# EAGLE design V2_eagle7 (EAGLE 7.7.0)

## Sheet 1 of 8: ATMEGA32
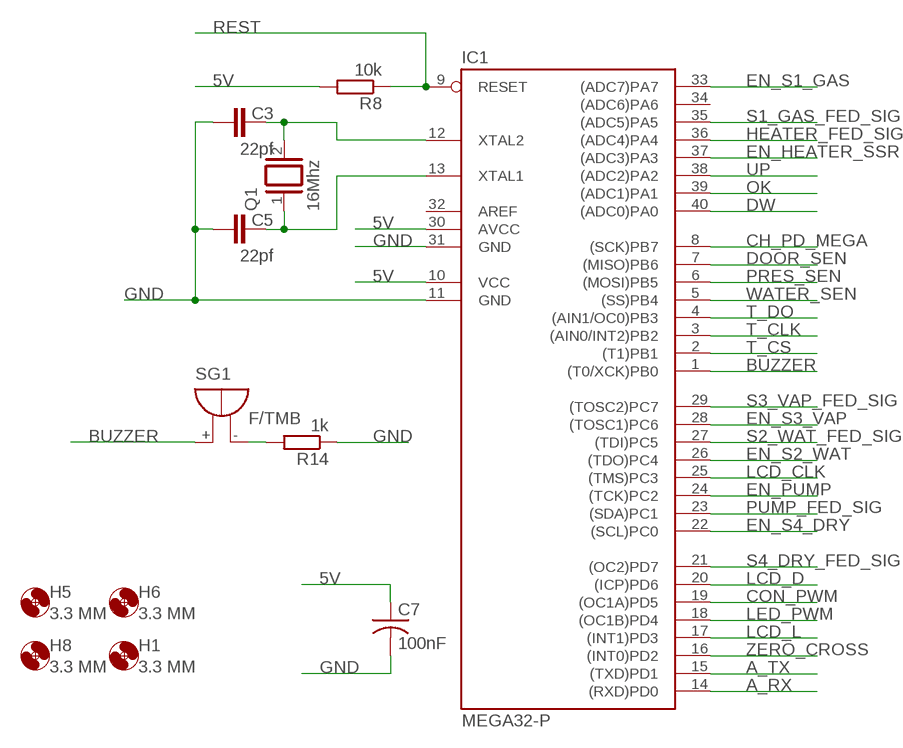
[diagram p0: schematic, sheet 1]

### Parts
C3  22pf  C-EU050-030X075  [C050-030X075]
C5  22pf  C-EU050-030X075  [C050-030X075]
C7  100nF  C-US050-035X075  [C050-035X075]
H1  3.3 MM  MOUNT-HOLE3.3  [3,3]
H5  3.3 MM  MOUNT-HOLE3.3  [3,3]
H6  3.3 MM  MOUNT-HOLE3.3  [3,3]
H8  3.3 MM  MOUNT-HOLE3.3  [3,3]
IC1  MEGA32-P  [DIL40]
Q1  16Mhz  XTAL/S  [QS]
R8  10k  R-EU_0207/10  [0207/10]
R14  1k  R-EU_0207/10  [0207/10]
SG1  F/TMB  [F/TMB]

### Nets
5V: C7.1 IC1.10(VCC) IC1.30(AVCC) R8.2 ; also sheet 2,7,8
A_RX: IC1.14((RXD)PD0) ; also sheet 4
A_TX: IC1.15((TXD)PD1) ; also sheet 4
BUZZER: IC1.1((T0/XCK)PB0) SG1.+
CH_PD_MEGA: IC1.8((SCK)PB7) ; also sheet 4
CON_PWM: IC1.19((OC1A)PD5) ; also sheet 3
DOOR_SEN: IC1.7((MISO)PB6) ; also sheet 6
DW: IC1.40((ADC0)PA0) ; also sheet 6
EN_HEATER_SSR: IC1.37((ADC3)PA3) ; also sheet 6
EN_PUMP: IC1.24((TCK)PC2) ; also sheet 2
EN_S1_GAS: IC1.33((ADC7)PA7) ; also sheet 2
EN_S2_WAT: IC1.26((TDO)PC4) ; also sheet 2
EN_S3_VAP: IC1.28((TOSC1)PC6) ; also sheet 2
EN_S4_DRY: IC1.22((SCL)PC0) ; also sheet 2
GND: C3.1 C5.1 C7.2 IC1.11(GND) IC1.31(GND) R14.1 ; also sheet 2,3,4,5,6,7,8
HEATER_FED_SIG: IC1.36((ADC4)PA4) ; also sheet 2
LCD_CLK: IC1.25((TMS)PC3) ; also sheet 3
LCD_D: IC1.20((ICP)PD6) ; also sheet 3
LCD_L: IC1.17((INT1)PD3) ; also sheet 3
LED_PWM: IC1.18((OC1B)PD4) ; also sheet 3
N$7: C5.2 IC1.13(XTAL1) Q1.1
N$16: C3.2 IC1.12(XTAL2) Q1.2
N$62: R14.2 SG1.-
OK: IC1.39((ADC1)PA1) ; also sheet 6
PRES_SEN: IC1.6((MOSI)PB5) ; also sheet 6
PUMP_FED_SIG: IC1.23((SDA)PC1) ; also sheet 2
REST: IC1.9(RESET) R8.1 ; also sheet 4
S1_GAS_FED_SIG: IC1.35((ADC5)PA5) ; also sheet 2
S2_WAT_FED_SIG: IC1.27((TDI)PC5) ; also sheet 2
S3_VAP_FED_SIG: IC1.29((TOSC2)PC7) ; also sheet 2
S4_DRY_FED_SIG: IC1.21((OC2)PD7) ; also sheet 2
T_CLK: IC1.3((AIN0/INT2)PB2) ; also sheet 8
T_CS: IC1.2((T1)PB1) ; also sheet 8
T_DO: IC1.4((AIN1/OC0)PB3) ; also sheet 8
UP: IC1.38((ADC2)PA2) ; also sheet 6
WATER_SEN: IC1.5((SS)PB4) ; also sheet 6
ZERO_CROSS: IC1.16((INT0)PD2) ; also sheet 5
Unconnected: IC1.32(AREF) IC1.34((ADC6)PA6)

## Sheet 2 of 8: Current Detect
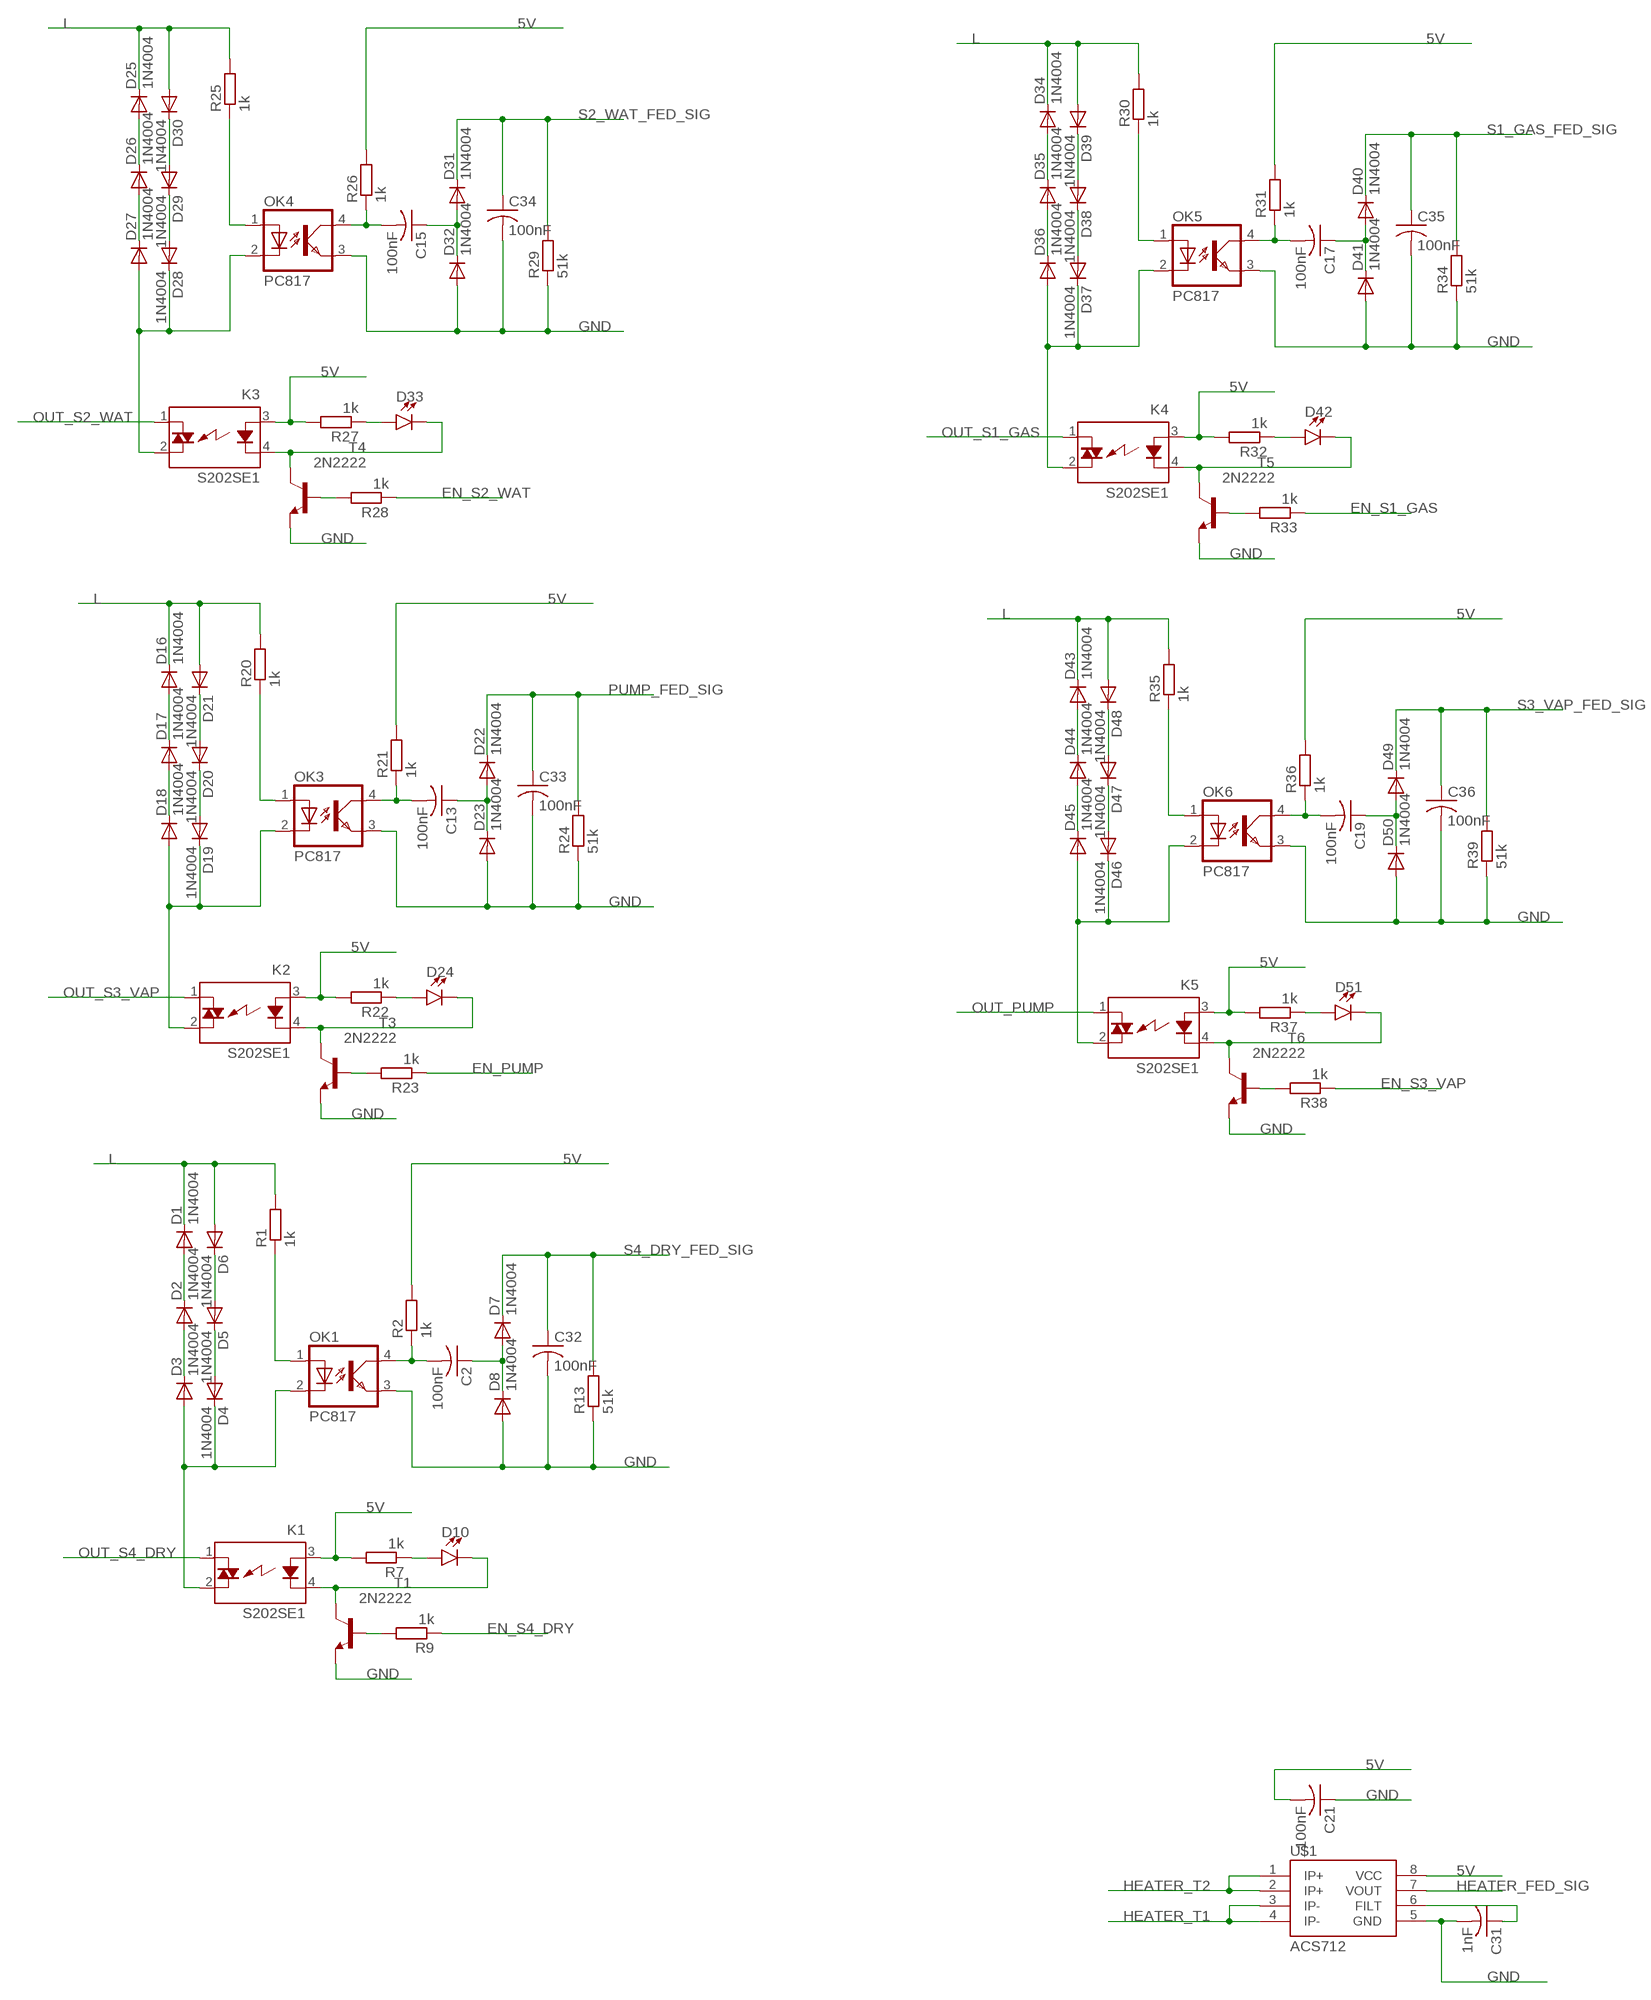
[diagram p1: schematic, sheet 2]

### Parts
C2  100nF  C-US050-035X075  [C050-035X075]
C13  100nF  C-US050-035X075  [C050-035X075]
C15  100nF  C-US050-035X075  [C050-035X075]
C17  100nF  C-US050-035X075  [C050-035X075]
C19  100nF  C-US050-035X075  [C050-035X075]
C21  100nF  C-US050-035X075  [C050-035X075]
C31  1nF  C-US050-035X075  [C050-035X075]
C32  100nF  C-US050-035X075  [C050-035X075]
C33  100nF  C-US050-035X075  [C050-035X075]
C34  100nF  C-US050-035X075  [C050-035X075]
C35  100nF  C-US050-035X075  [C050-035X075]
C36  100nF  C-US050-035X075  [C050-035X075]
D1  1N4004  [DO41-10]
D2  1N4004  [DO41-10]
D3  1N4004  [DO41-10]
D4  1N4004  [DO41-10]
D5  1N4004  [DO41-10]
D6  1N4004  [DO41-10]
D7  1N4004  [DO41-10]
D8  1N4004  [DO41-10]
D10  LED5MM  [LED_5MM]
D16  1N4004  [DO41-10]
D17  1N4004  [DO41-10]
D18  1N4004  [DO41-10]
D19  1N4004  [DO41-10]
D20  1N4004  [DO41-10]
D21  1N4004  [DO41-10]
D22  1N4004  [DO41-10]
D23  1N4004  [DO41-10]
D24  LED5MM  [LED_5MM]
D25  1N4004  [DO41-10]
D26  1N4004  [DO41-10]
D27  1N4004  [DO41-10]
D28  1N4004  [DO41-10]
D29  1N4004  [DO41-10]
D30  1N4004  [DO41-10]
D31  1N4004  [DO41-10]
D32  1N4004  [DO41-10]
D33  LED5MM  [LED_5MM]
D34  1N4004  [DO41-10]
D35  1N4004  [DO41-10]
D36  1N4004  [DO41-10]
D37  1N4004  [DO41-10]
D38  1N4004  [DO41-10]
D39  1N4004  [DO41-10]
D40  1N4004  [DO41-10]
D41  1N4004  [DO41-10]
D42  LED5MM  [LED_5MM]
D43  1N4004  [DO41-10]
D44  1N4004  [DO41-10]
D45  1N4004  [DO41-10]
D46  1N4004  [DO41-10]
D47  1N4004  [DO41-10]
D48  1N4004  [DO41-10]
D49  1N4004  [DO41-10]
D50  1N4004  [DO41-10]
D51  LED5MM  [LED_5MM]
K1  S202SE1  [S2XXEX]
K2  S202SE1  [S2XXEX]
K3  S202SE1  [S2XXEX]
K4  S202SE1  [S2XXEX]
K5  S202SE1  [S2XXEX]
OK1  PC817  [DIL04]
OK3  PC817  [DIL04]
OK4  PC817  [DIL04]
OK5  PC817  [DIL04]
OK6  PC817  [DIL04]
R1  1k  R-EU_0207/10  [0207/10]
R2  1k  R-EU_0207/10  [0207/10]
R7  1k  R-EU_0207/10  [0207/10]
R9  1k  R-EU_0207/10  [0207/10]
R13  51k  R-EU_0207/10  [0207/10]
R20  1k  R-EU_0207/10  [0207/10]
R21  1k  R-EU_0207/10  [0207/10]
R22  1k  R-EU_0207/10  [0207/10]
R23  1k  R-EU_0207/10  [0207/10]
R24  51k  R-EU_0207/10  [0207/10]
R25  1k  R-EU_0207/10  [0207/10]
R26  1k  R-EU_0207/10  [0207/10]
R27  1k  R-EU_0207/10  [0207/10]
R28  1k  R-EU_0207/10  [0207/10]
R29  51k  R-EU_0207/10  [0207/10]
R30  1k  R-EU_0207/10  [0207/10]
R31  1k  R-EU_0207/10  [0207/10]
R32  1k  R-EU_0207/10  [0207/10]
R33  1k  R-EU_0207/10  [0207/10]
R34  51k  R-EU_0207/10  [0207/10]
R35  1k  R-EU_0207/10  [0207/10]
R36  1k  R-EU_0207/10  [0207/10]
R37  1k  R-EU_0207/10  [0207/10]
R38  1k  R-EU_0207/10  [0207/10]
R39  51k  R-EU_0207/10  [0207/10]
T1  2N2222  [TO92-EBC-OVAL]
T3  2N2222  [TO92-EBC-OVAL]
T4  2N2222  [TO92-EBC-OVAL]
T5  2N2222  [TO92-EBC-OVAL]
T6  2N2222  [TO92-EBC-OVAL]
U$1  ACS712  [SO08]

### Nets
5V: C21.2 K1.3(A) K2.3(A) K3.3(A) K4.3(A) K5.3(A) R2.2 R7.2 R21.2 R22.2 R26.2 R27.2 R31.2 R32.2 R36.2 R37.2 U$1.8(VCC) ; also sheet 1,7,8
EN_PUMP: R23.1 ; also sheet 1
EN_S1_GAS: R33.1 ; also sheet 1
EN_S2_WAT: R28.1 ; also sheet 1
EN_S3_VAP: R38.1 ; also sheet 1
EN_S4_DRY: R9.1 ; also sheet 1
GND: C21.1 C31.2 C32.2 C33.2 C34.2 C35.2 C36.2 D8.A D23.A D32.A D41.A D50.A OK1.3(EMIT) OK3.3(EMIT) OK4.3(EMIT) OK5.3(EMIT) OK6.3(EMIT) R13.1 R24.1 R29.1 R34.1 R39.1 T1.E T3.E T4.E T5.E T6.E U$1.5(GND) ; also sheet 1,3,4,5,6,7,8
HEATER_FED_SIG: U$1.7(VOUT) ; also sheet 1
HEATER_T1: U$1.3(IP-) U$1.4(IP-) ; also sheet 6
HEATER_T2: U$1.1(IP+) U$1.2(IP+) ; also sheet 6
L: D1.C D6.A D16.C D21.A D25.C D30.A D34.C D39.A D43.C D48.A R1.2 R20.2 R25.2 R30.2 R35.2 ; also sheet 6
N$1: D2.A D3.C
N$2: D1.A D2.C
N$3: C2.2 OK1.4(COL) R2.1
N$4: C2.1 D7.A D8.C
N$5: D5.A D6.C
N$6: D4.A D5.C
N$8: D10.K(C) K1.4(K) T1.C
N$9: OK1.1(A) R1.1
N$10: D17.A D18.C
N$11: D10.A R7.1
N$13: R9.2 T1.B
N$14: D3.A D4.C K1.2(DS2) OK1.2(C)
N$15: D16.A D17.C
N$17: D20.A D21.C
N$18: D19.A D20.C
N$19: OK3.1(A) R20.1
N$20: C13.2 OK3.4(COL) R21.1
N$21: C13.1 D22.A D23.C
N$22: D18.A D19.C K2.2(DS2) OK3.2(C)
N$23: D24.A R22.1
N$24: D24.K(C) K2.4(K) T3.C
N$25: R23.2 T3.B
N$26: D26.A D27.C
N$27: D25.A D26.C
N$28: D29.A D30.C
N$29: D28.A D29.C
N$30: OK4.1(A) R25.1
N$31: C15.2 OK4.4(COL) R26.1
N$32: C15.1 D31.A D32.C
N$33: D27.A D28.C K3.2(DS2) OK4.2(C)
N$34: D33.A R27.1
N$35: D33.K(C) K3.4(K) T4.C
N$36: R28.2 T4.B
N$37: D35.A D36.C
N$38: D34.A D35.C
N$39: D38.A D39.C
N$40: D37.A D38.C
N$41: OK5.1(A) R30.1
N$42: C17.2 OK5.4(COL) R31.1
N$43: C17.1 D40.A D41.C
N$44: D36.A D37.C K4.2(DS2) OK5.2(C)
N$45: D42.A R32.1
N$46: D42.K(C) K4.4(K) T5.C
N$52: R33.2 T5.B
N$53: D44.A D45.C
N$56: D43.A D44.C
N$57: D47.A D48.C
N$58: D46.A D47.C
N$59: OK6.1(A) R35.1
N$60: C19.2 OK6.4(COL) R36.1
N$61: C19.1 D49.A D50.C
N$63: D45.A D46.C K5.2(DS2) OK6.2(C)
N$64: D51.A R37.1
N$65: D51.K(C) K5.4(K) T6.C
N$66: R38.2 T6.B
N$80: C31.1 U$1.6(FILT)
OUT_PUMP: K5.1(DS1) ; also sheet 6
OUT_S1_GAS: K4.1(DS1) ; also sheet 6
OUT_S2_WAT: K3.1(DS1) ; also sheet 6
OUT_S3_VAP: K2.1(DS1) ; also sheet 6
OUT_S4_DRY: K1.1(DS1) ; also sheet 6
PUMP_FED_SIG: C33.1 D22.C R24.2 ; also sheet 1
S1_GAS_FED_SIG: C35.1 D40.C R34.2 ; also sheet 1
S2_WAT_FED_SIG: C34.1 D31.C R29.2 ; also sheet 1
S3_VAP_FED_SIG: C36.1 D49.C R39.2 ; also sheet 1
S4_DRY_FED_SIG: C32.1 D7.C R13.2 ; also sheet 1

## Sheet 3 of 8: LCD_Shift
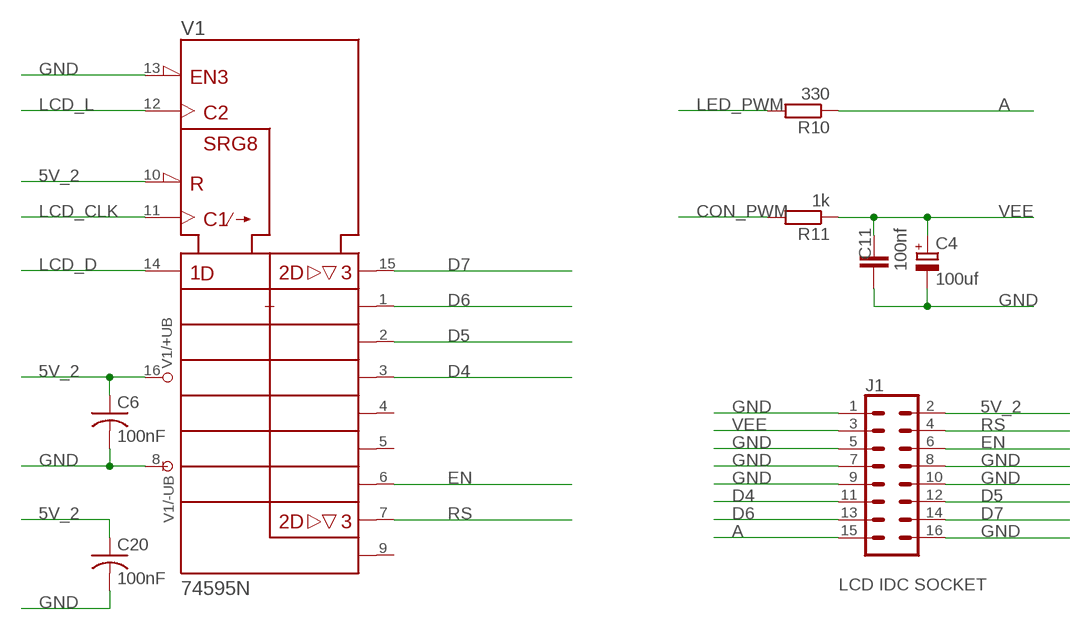
[diagram p2: schematic, sheet 3]

### Parts
C4  100uf  CPOL-EUE3.5-8  [E3,5-8]
C6  100nF  C-US050-035X075  [C050-035X075]
C11  100nf  C-EU050-030X075  [C050-030X075]
C20  100nF  C-US050-035X075  [C050-035X075]
J1  CONN_08X2  [2X8]
R10  330  R-EU_0207/10  [0207/10]
R11  1k  R-EU_0207/10  [0207/10]
V1  74595N  [DIL16]

### Nets
5V_2: C6.1 C20.1 J1.2 V1.10(!SRCLR) V1.16(+UB) ; also sheet 5,7
A: J1.15 R10.1
CON_PWM: R11.2 ; also sheet 1
D4: J1.11 V1.3(QD)
D5: J1.12 V1.2(QC)
D6: J1.13 V1.1(QB)
D7: J1.14 V1.15(QA)
EN: J1.6 V1.6(QG)
GND: C4.- C6.2 C11.1 C20.2 J1.1 J1.5 J1.7 J1.8 J1.9 J1.10 J1.16 V1.8(-UB) V1.13(!G) ; also sheet 1,2,4,5,6,7,8
LCD_CLK: V1.11(SRCK) ; also sheet 1
LCD_D: V1.14(SER) ; also sheet 1
LCD_L: V1.12(RCK) ; also sheet 1
LED_PWM: R10.2 ; also sheet 1
RS: J1.4 V1.7(QH)
VEE: C4.+ C11.2 J1.3 R11.1
Unconnected: V1.4(QE) V1.5(QF) V1.9(QH*)

### Notes on the sheet
- LCD IDC SOCKET

## Sheet 4 of 8: ESP LINK
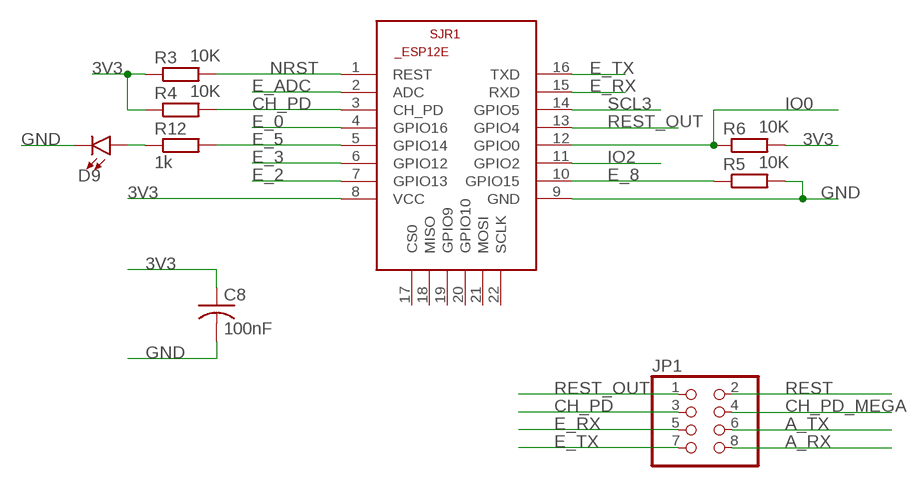
[diagram p3: schematic, sheet 4]

### Parts
C8  100nF  C-US050-035X075  [C050-035X075]
D9  LED5MM  [LED_5MM]
JP1  PINHD-2X4  [2X04]
R3  10K  R-EU_0207/10  [0207/10]
R4  10K  R-EU_0207/10  [0207/10]
R5  10K  R-EU_0207/10  [0207/10]
R6  10K  R-EU_0207/10  [0207/10]
R12  1k  R-EU_0207/10  [0207/10]
SJR1  ESP8266-12EESP12E  [ESP8266-ESP12E]

### Nets
3V3: C8.1 R3.1 R4.1 R6.2 SJR1.8(VCC) ; also sheet 7
A_RX: JP1.8 ; also sheet 1
A_TX: JP1.6 ; also sheet 1
CH_PD: JP1.3 R4.2 SJR1.3(CH_PD)
CH_PD_MEGA: JP1.4 ; also sheet 1
E_0: SJR1.4(GPIO16)
E_2: SJR1.7(GPIO13)
E_3: SJR1.6(GPIO12)
E_5: R12.2 SJR1.5(GPIO14)
E_8: R5.1 SJR1.10(GPIO15)
E_ADC: SJR1.2(ADC)
E_RX: JP1.5 SJR1.15(RXD)
E_TX: JP1.7 SJR1.16(TXD)
GND: C8.2 D9.K(C) R5.2 SJR1.9(GND) ; also sheet 1,2,3,5,6,7,8
IO0: R6.1 SJR1.12(GPIO0)
IO2: SJR1.11(GPIO2)
N$12: D9.A R12.1
NRST: R3.2 SJR1.1(REST)
REST: JP1.2 ; also sheet 1
REST_OUT: JP1.1 SJR1.13(GPIO4)
SCL3: SJR1.14(GPIO5)
Unconnected: SJR1.17(CS0) SJR1.18(MISO) SJR1.19(GPIO9) SJR1.20(GPIO10) SJR1.21(MOSI) SJR1.22(SCLK)

## Sheet 5 of 8: Zero_Cross Detect
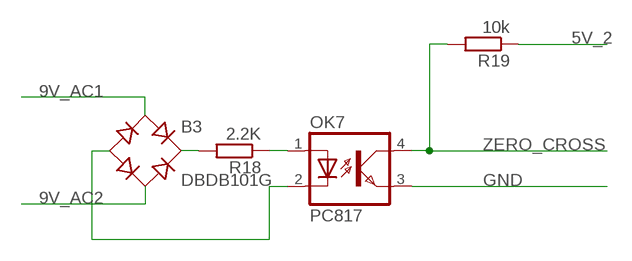
[diagram p4: schematic, sheet 5]

### Parts
B3  DBDB101G  [DB]
OK7  PC817  [DIL04]
R18  2.2K  R-EU_0207/10  [0207/10]
R19  10k  R-EU_0207/10  [0207/10]

### Nets
5V_2: R19.1 ; also sheet 3,7
9V_AC1: B3.AC1 ; also sheet 6,7
9V_AC2: B3.AC2 ; also sheet 6,7
GND: OK7.3(EMIT) ; also sheet 1,2,3,4,6,7,8
N$47: B3.+ R18.2
N$48: OK7.1(A) R18.1
N$49: B3.- OK7.2(C)
ZERO_CROSS: OK7.4(COL) R19.2 ; also sheet 1

## Sheet 6 of 8: Terminals
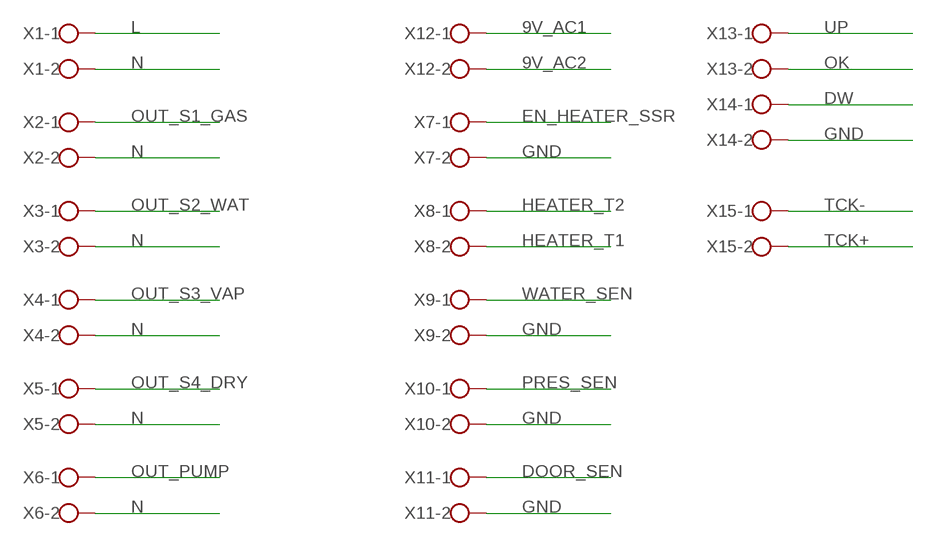
[diagram p5: schematic, sheet 6]

### Parts
X1  W237-102  [W237-102]
X2  W237-102  [W237-102]
X3  W237-102  [W237-102]
X4  W237-102  [W237-102]
X5  W237-102  [W237-102]
X6  W237-102  [W237-102]
X7  W237-102  [W237-102]
X8  W237-102  [W237-102]
X9  W237-102  [W237-102]
X10  W237-102  [W237-102]
X11  W237-102  [W237-102]
X12  W237-102  [W237-102]
X13  W237-102  [W237-102]
X14  W237-102  [W237-102]
X15  W237-102  [W237-102]

### Nets
9V_AC1: X12.1 ; also sheet 5,7
9V_AC2: X12.2 ; also sheet 5,7
DOOR_SEN: X11.1 ; also sheet 1
DW: X14.1 ; also sheet 1
EN_HEATER_SSR: X7.1 ; also sheet 1
GND: X7.2 X9.2 X10.2 X11.2 X14.2 ; also sheet 1,2,3,4,5,7,8
HEATER_T1: X8.2 ; also sheet 2
HEATER_T2: X8.1 ; also sheet 2
L: X1.1 ; also sheet 2
N: X1.2 X2.2 X3.2 X4.2 X5.2 X6.2
OK: X13.2 ; also sheet 1
OUT_PUMP: X6.1 ; also sheet 2
OUT_S1_GAS: X2.1 ; also sheet 2
OUT_S2_WAT: X3.1 ; also sheet 2
OUT_S3_VAP: X4.1 ; also sheet 2
OUT_S4_DRY: X5.1 ; also sheet 2
PRES_SEN: X10.1 ; also sheet 1
TCK+: X15.2 ; also sheet 8
TCK-: X15.1 ; also sheet 8
UP: X13.1 ; also sheet 1
WATER_SEN: X9.1 ; also sheet 1

## Sheet 7 of 8: POWER
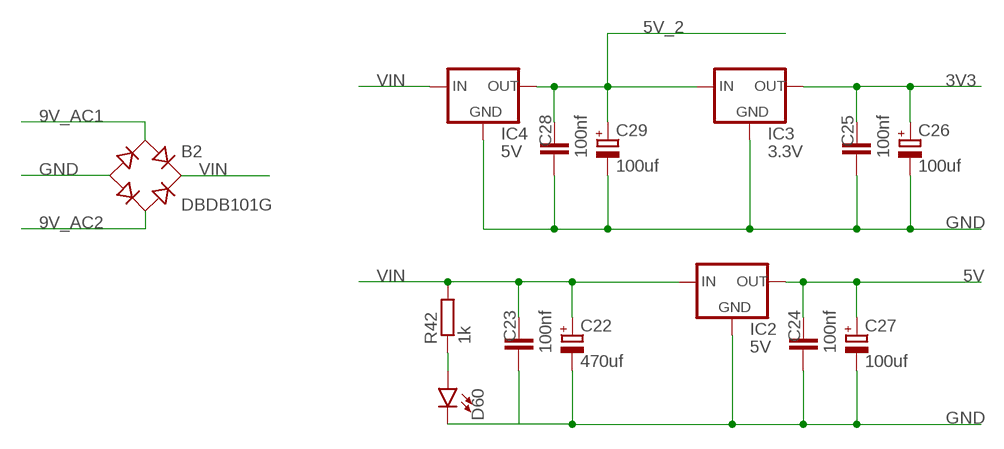
[diagram p6: schematic, sheet 7]

### Parts
B2  DBDB101G  [DB]
C22  470uf  CPOL-EUE3.5-8  [E3,5-8]
C23  100nf  C-EU050-030X075  [C050-030X075]
C24  100nf  C-EU050-030X075  [C050-030X075]
C25  100nf  C-EU050-030X075  [C050-030X075]
C26  100uf  CPOL-EUE3.5-8  [E3,5-8]
C27  100uf  CPOL-EUE3.5-8  [E3,5-8]
C28  100nf  C-EU050-030X075  [C050-030X075]
C29  100uf  CPOL-EUE3.5-8  [E3,5-8]
D60  LED5MM  [LED_5MM]
IC2  5V  V_REG_78XXSIDE  [78XXL]
IC3  3.3V  V_REG_78XXSIDE  [78XXL]
IC4  5V  V_REG_78XXSIDE  [78XXL]
R42  1k  R-EU_0207/10  [0207/10]

### Nets
3V3: C25.2 C26.+ IC3.OUT ; also sheet 4
5V: C24.2 C27.+ IC2.OUT ; also sheet 1,2,8
5V_2: C28.2 C29.+ IC3.IN IC4.OUT ; also sheet 3,5
9V_AC1: B2.AC1 ; also sheet 5,6
9V_AC2: B2.AC2 ; also sheet 5,6
GND: B2.- C22.- C23.1 C24.1 C25.1 C26.- C27.- C28.1 C29.- D60.K(C) IC2.GND IC3.GND IC4.GND ; also sheet 1,2,3,4,5,6,8
N$74: D60.A R42.1
VIN: B2.+ C22.+ C23.2 IC2.IN IC4.IN R42.2

## Sheet 8 of 8: Thermocoupler
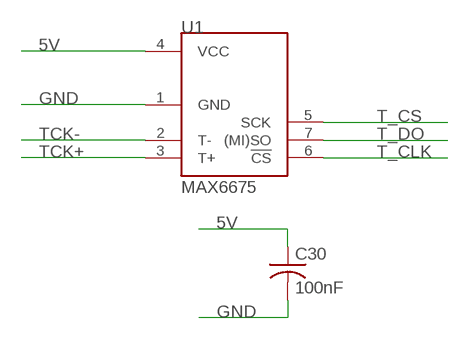
[diagram p7: schematic, sheet 8]

### Parts
C30  100nF  C-US050-035X075  [C050-035X075]
U1  MAX6675  [SOIC8]

### Nets
5V: C30.1 U1.4(VCC) ; also sheet 1,2,7
GND: C30.2 U1.1(GND) ; also sheet 1,2,3,4,5,6,7
T_CLK: U1.6(!CS) ; also sheet 1
T_CS: U1.5(SCK) ; also sheet 1
T_DO: U1.7((MI)SO) ; also sheet 1
TCK+: U1.3(T+) ; also sheet 6
TCK-: U1.2(T-) ; also sheet 6

## Library data of the parts
B2 B3 = rectifier:DB?*G: Single Phase 1.0 AMP Glass Passivated Bridge Rectifier Taiwan Semiconductor Co.,Ltd. - TSC Source: http://www.taiwansemi.com/TSCbig5/ezcatfiles/cust/img/img/db101g.pdf http://www.ts.com.tw/db/pictures/modules/PDT/PDT060207001/DBLS201G.pdf
C2 C6-C8 C13 C15 C17 C19-C21 C30-C36 = rcl@1:C-US: CAPACITOR, American symbol; SPICEPREFIX: C
C3 C5 C11 C23-C25 C28 = rcl:C-EU: CAPACITOR, European symbol
C4 C22 C26 C27 C29 = rcl:CPOL-EU: POLARIZED CAPACITOR, European symbol
D1-D8 D16-D23 D25-D32 D34-D41 D43-D50 = adafruit:1N4004: DIODE General purpose 1N400x type rectifier (With bigger pads) http://www.ladyada.net/library/pcb/eaglelibrary.html
D9 D10 D24 D33 D42 D51 D60 = SparkFun-LED:LED: LED (Generic) Standard schematic elements and footprints for 5mm, 3mm, 1206, and 0603 sized LEDs. Generic LEDs with no color specified.
H1 H5 H6 H8 = holes:MOUNT-HOLE: MOUNTING HOLE with drill center marker
IC1 = atmel:MEGA32-P: MICROCONTROLLER 32 Kbytes FLASH 2 Kbytes SRAM 1 Kbytes EEPROM USART 8-channel 10 bit ADC Source: www.atmel.com .. doc2503.pdf; MPN: ATMEGA32-16PU; OC_FARNELL: 1661729; OC_NEWARK: 51P1794
IC2-IC4 = SparkFun:V_REG_78XX: Voltage Regulator Standard 7805 5V regulator. IGO (Input Ground Output). Spark Fun Electronics SKU : COM-00107
J1 = SparkFun-Connectors:CONN_08X2: Multi connection point. Often used as Generic Header-pin footprint for 0.1 inch spaced/style header connections You can populate with any combo of single row headers, but if you'd like an exact match, check this: Header - 2x8 (Male, 0.1") <https://www.sparkfun.com/products/13156> (PRT-13156) On any of the 0.1 inch spaced packages, you can populate with these: Break Away Headers - Straight <https://www.sparkfun.com/products/116> (PRT-00116) Break Away Male Headers - Right Angle <https://www.sparkfun.com/products/553> (PRT-00553) Female Headers <https://www.sparkfun.com/products/115> (PRT-00115) Break Away Headers - Machine Pin <https://www.sparkfun.com/products/117> (PRT-00117) Break Away Female Headers - Swiss Machine Pin <https://www.sparkfun.com/products/743> (PRT-00743)
JP1 = pinhead:PINHD-2X4: PIN HEADER
K1-K5 = relay:S2*: SIP Type SSR for Medium Power Control SHARP Source: 168149-da-01-en-Solid_State_Relais_S_202_SE1_SE2.pdf; OC_FARNELL: unknown; OC_NEWARK: unknown
OK1 OK3-OK7 = optocoupler-2:PC817: SHARP OPTO COUPLER
Q1 = special:XTAL/S: CRYSTAL
R1 R2 R7-R14 R18-R39 R42 = rcl:R-EU_: RESISTOR, European symbol
R3-R6 = rcl@1:R-EU_: RESISTOR, European symbol; SPICEPREFIX: R
SG1 = buzzer:F/TMB: BUZZER Source: Buerklin; OC_FARNELL: unknown; OC_NEWARK: unknown
SJR1 = esp12e:ESP8266-12E: ESP8266-12E Library for Eagle CAD The author not responsible for any damages or errors!. Created by Suhail jr.lt;/author>
T1 T3-T6 = adafruit:2N2222: NPN TRANSISTOR Big oval pads
U1 = SparkFun-Retired:MAX6675: Cold-Junction-Compensated K-Thermocoupleto-Digital Converter (0°C to +1024°C) The MAX6675 performs cold-junction compensation and digitizes the signal from a type-K thermocouple. The data is output in a 12-bit resolution, SPI™-compatible, read-only format. This converter resolves temperatures to 0.25°C, allows readings as high as +1024°C, and exhibits thermocouple accuracy of 8LSBs for temperatures ranging from 0°C to +700°C. Dead Prototype: IC-12512; PROD_ID: IC-12512
U$1 = SparkFun-Sensors:ACS712: ACS712 Hall-effect-based isolated linear current sensor Datasheet <http://www.sparkfun.com/datasheets/BreakoutBoards/0712.pdf> SparkFun Products SparkFun Low Current Sensor Breakout - ACS712 <https://www.sparkfun.com/products/8883> (SEN-08883); PROD_ID: IC-08964
V1 = 74ttl-din:74*595: 8-bit SHIFT REGISTER, output latch
X1-X15 = con-wago-500:W237-102: WAGO SCREW CLAMP; MPN: 237-102; OC_FARNELL: unknown; OC_NEWARK: 70K9898

## Board
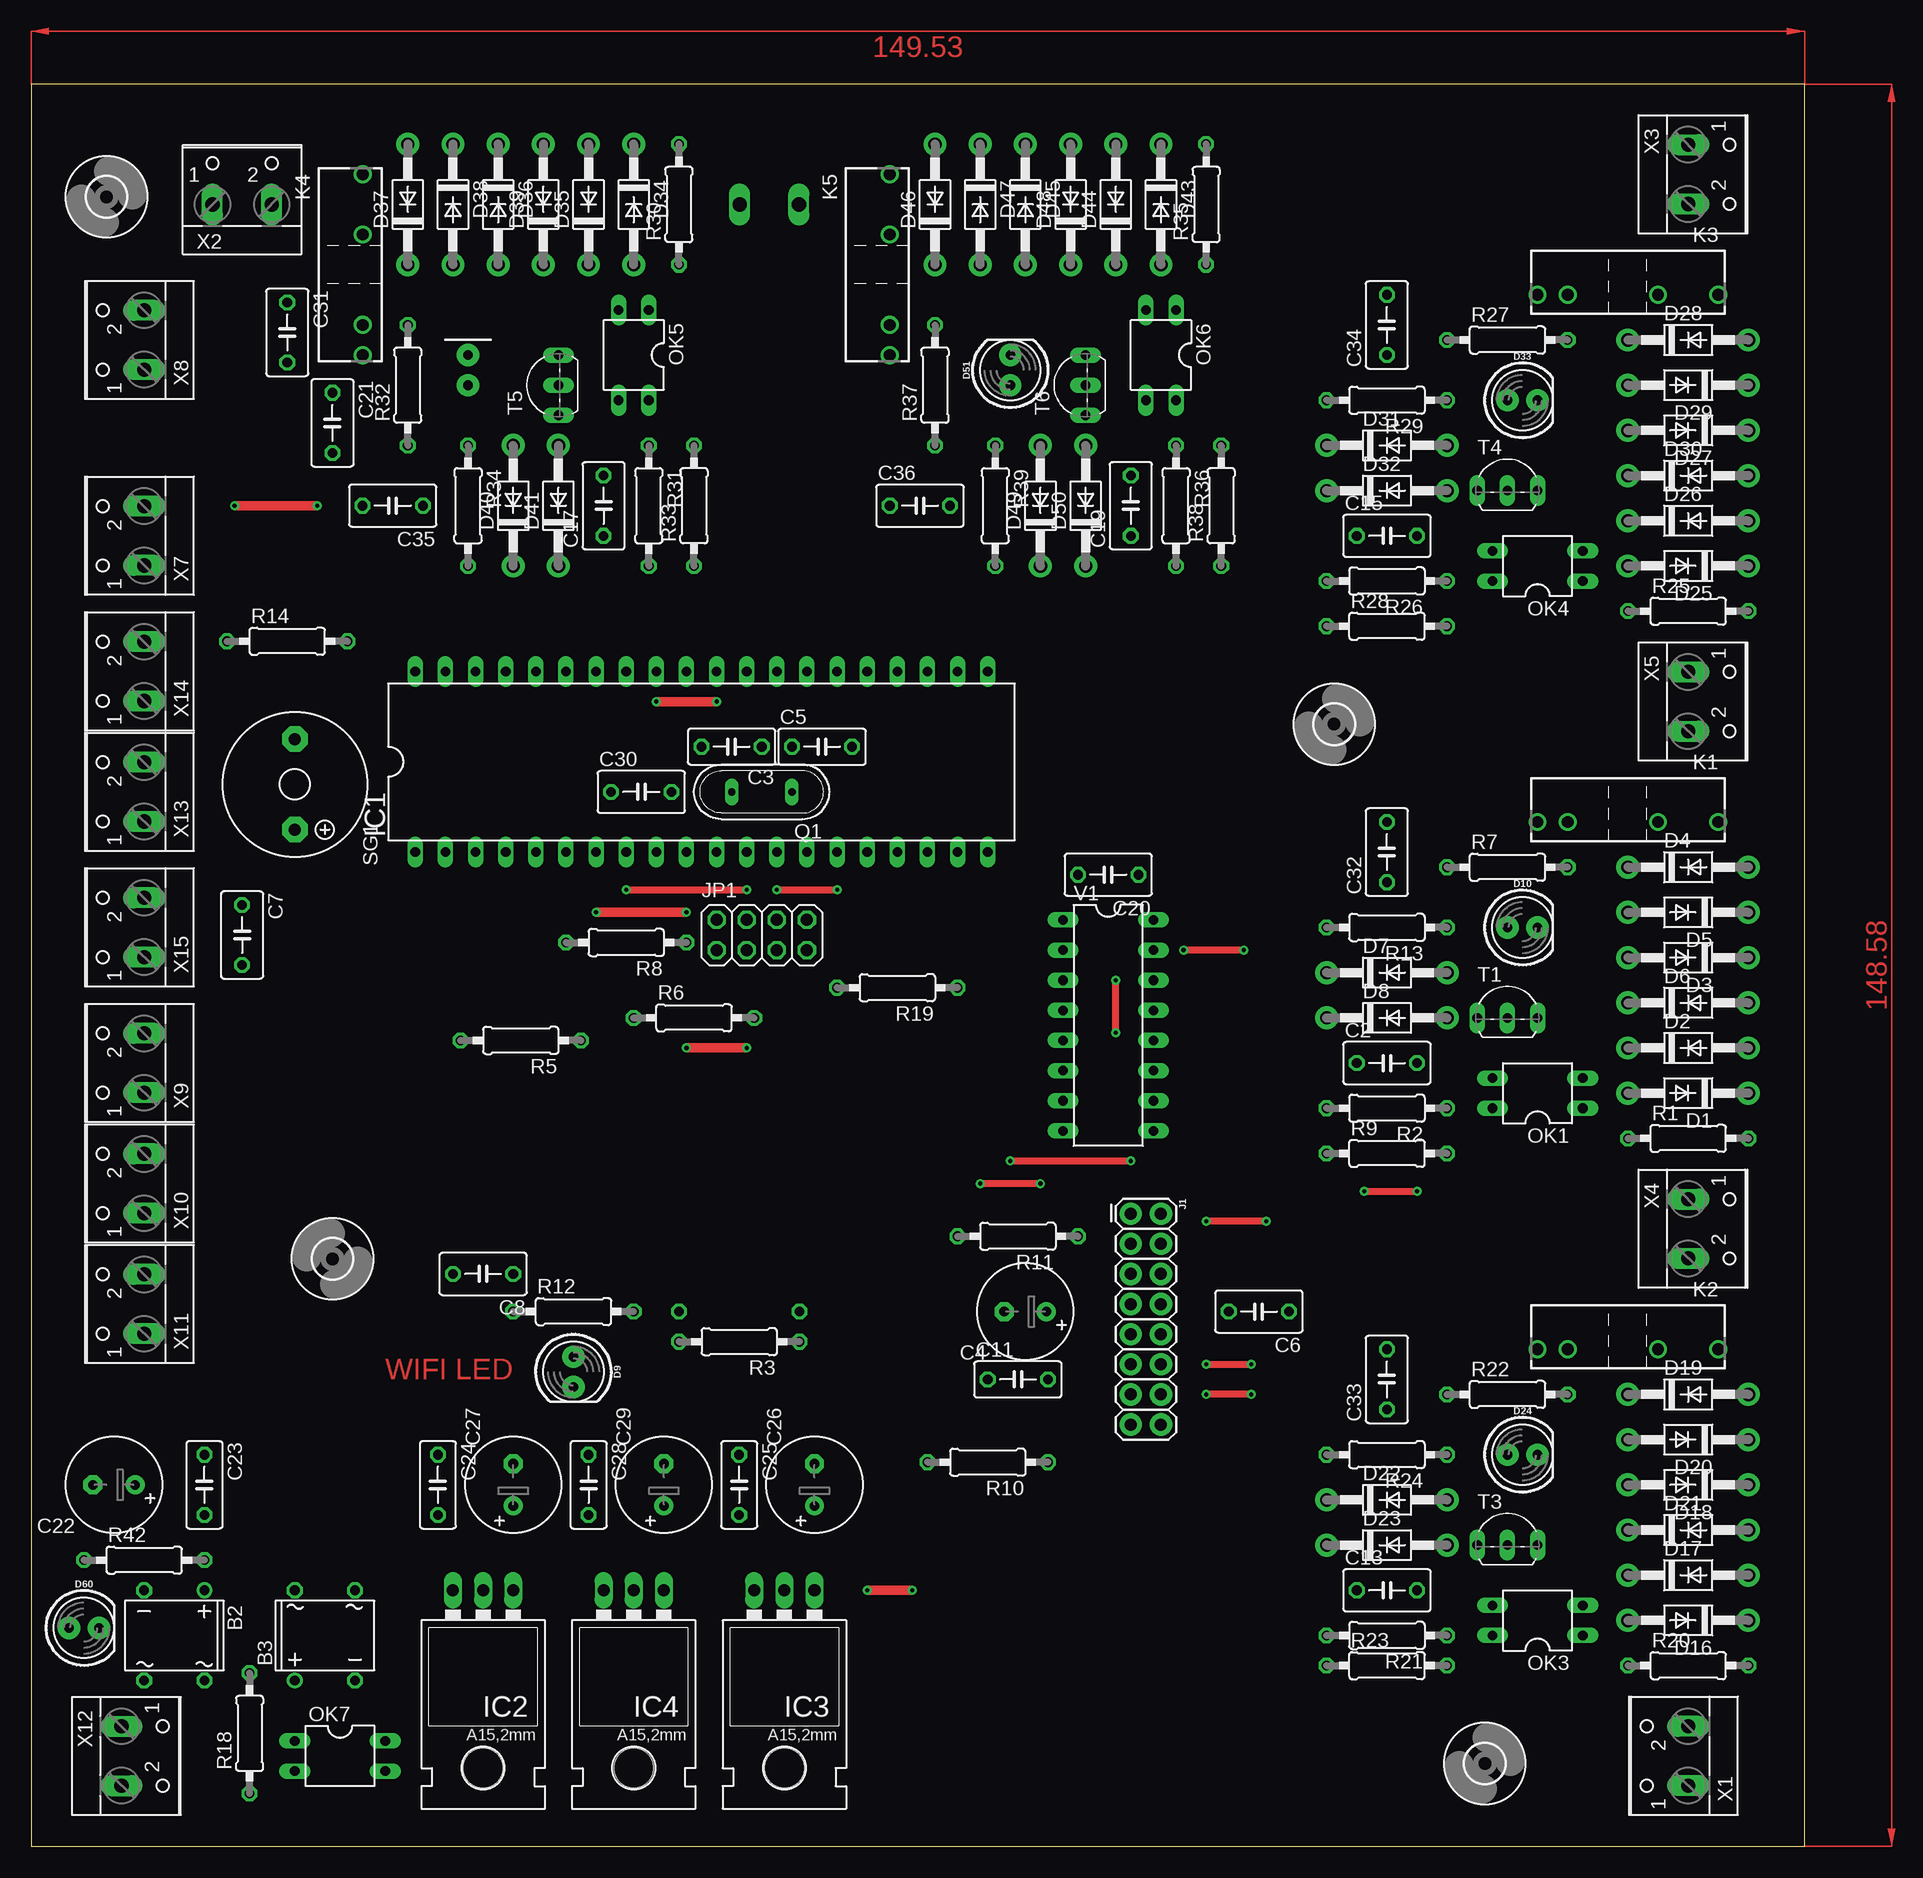
[diagram p8: board, top side]
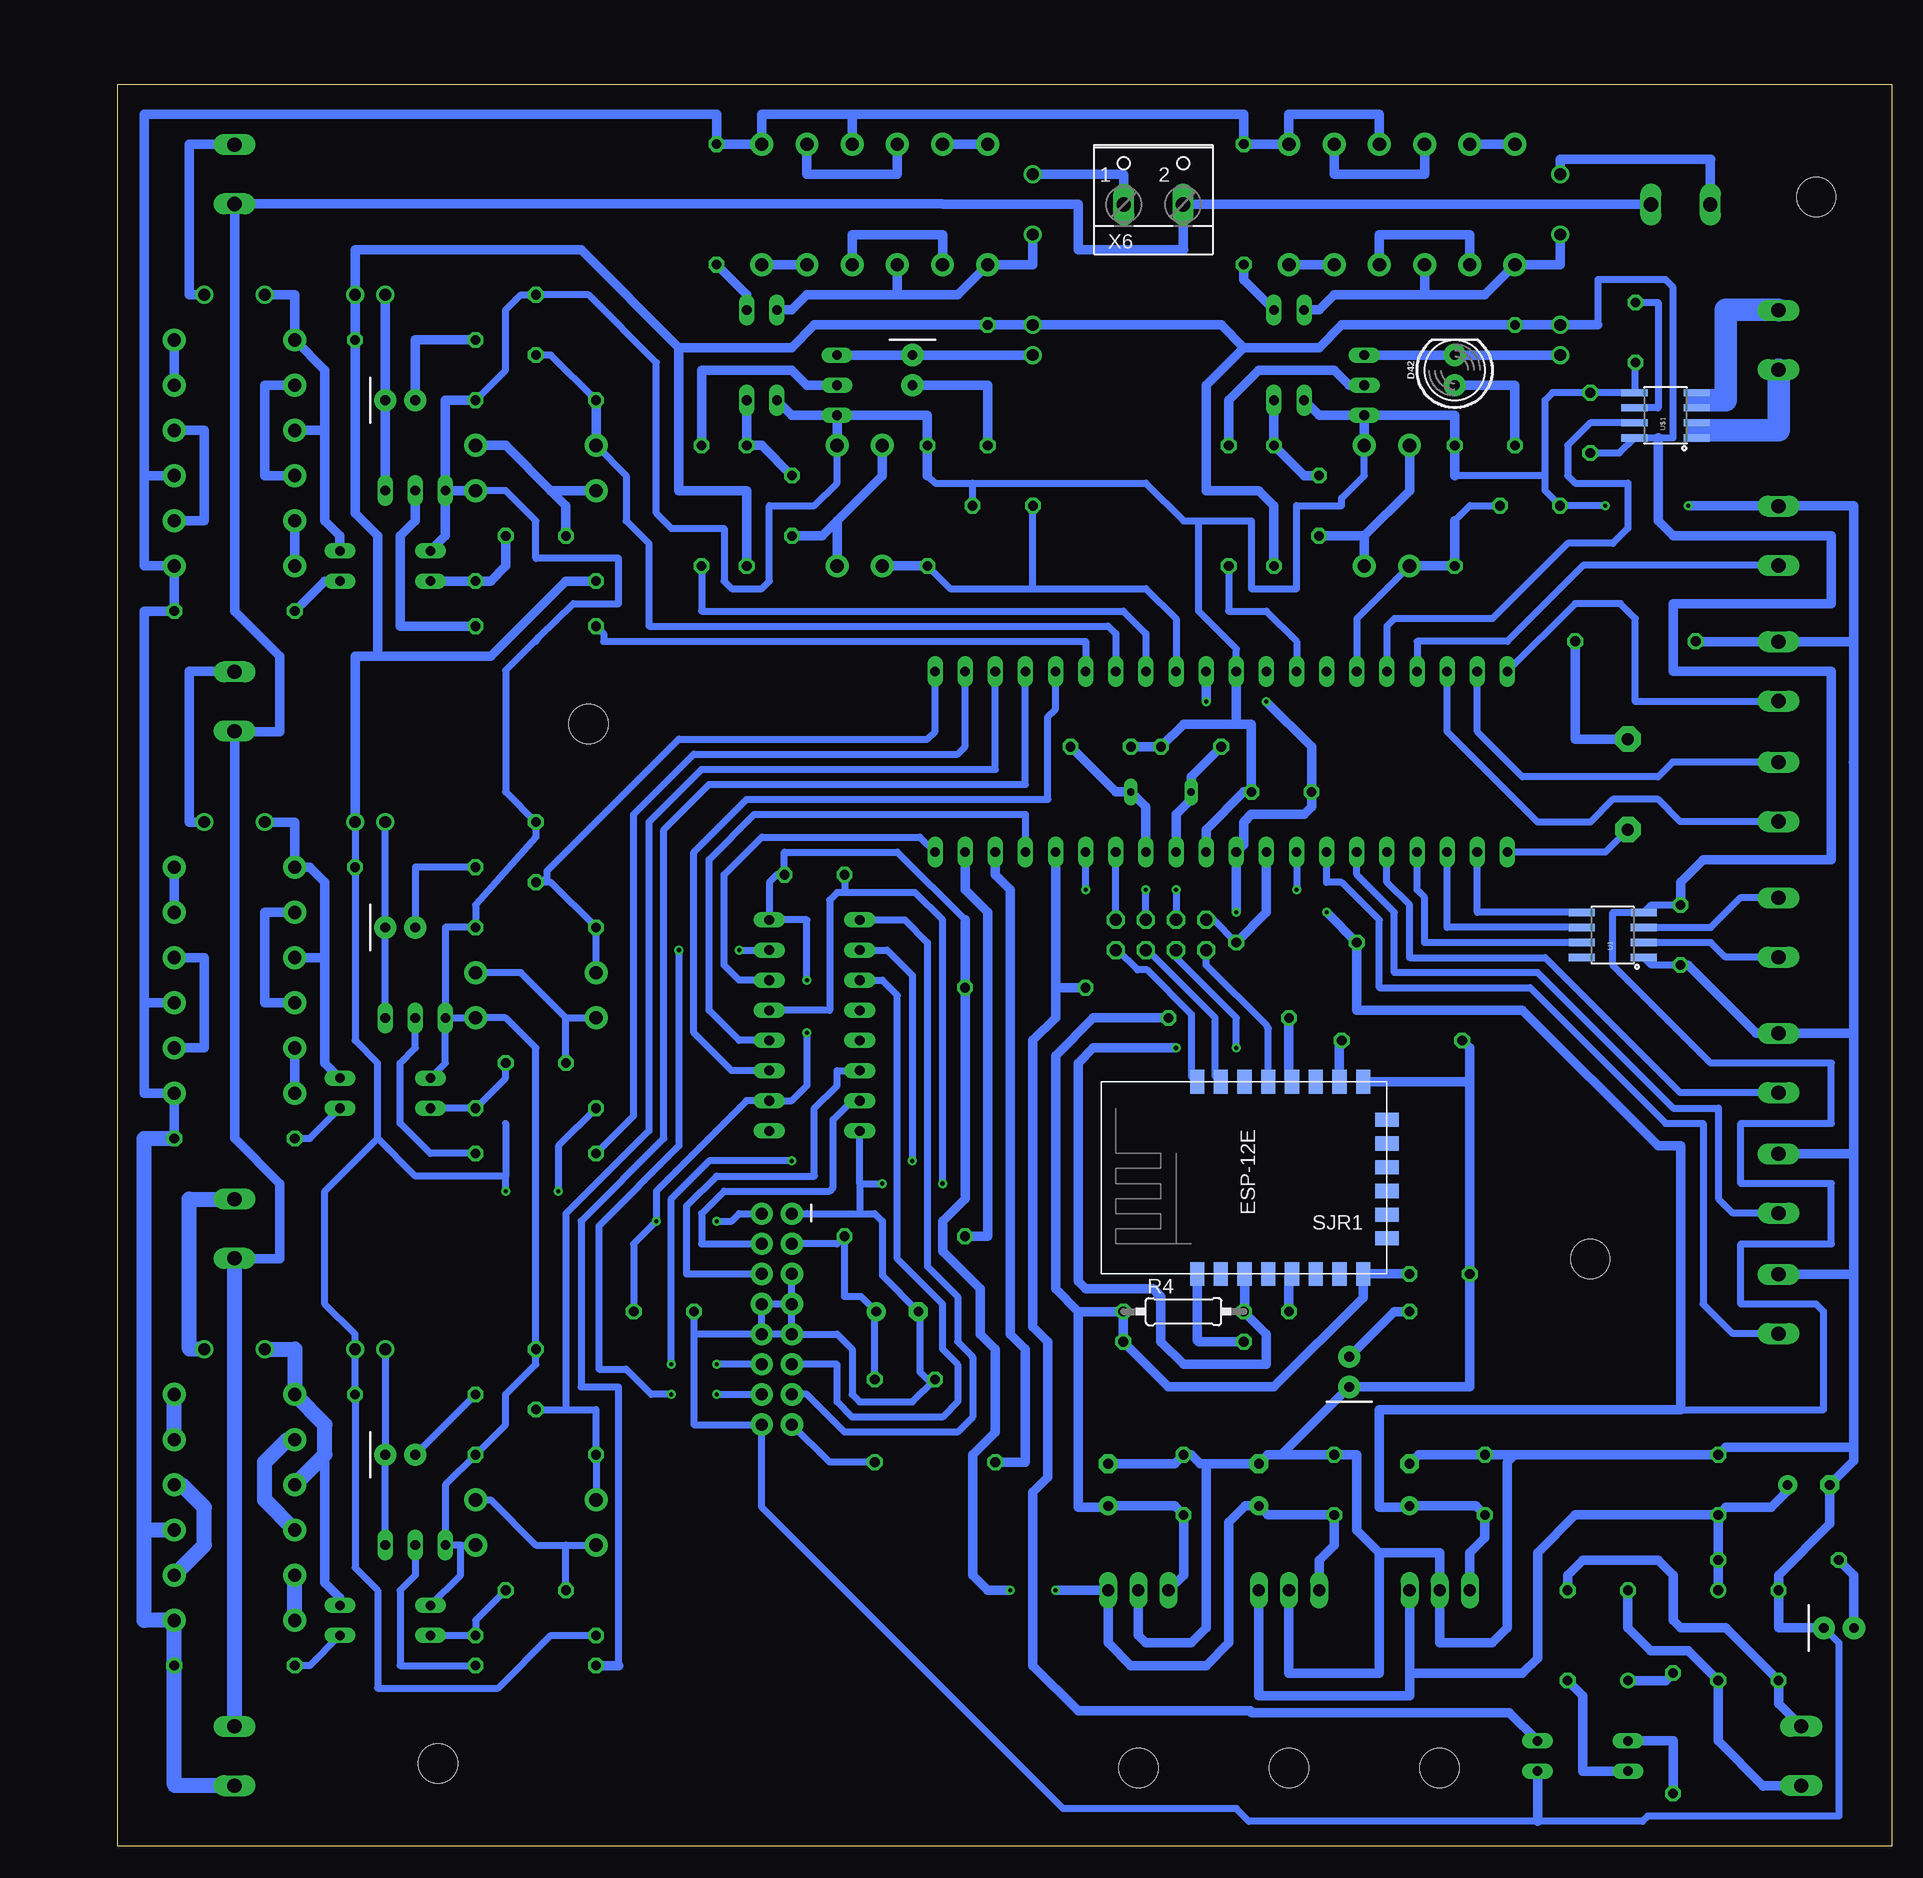
[diagram p9: board, bottom side, seen from below]

Size 149.53 x 148.58 mm. Coordinates in mm from the lower left corner, seen from the top.
Outline: 0,0 149.53,0 149.53,148.58 0,148.58 0,0
Copper layers (1*16): Top 0.035mm / dielectric 1.5mm / Bottom 0.035mm
Design rules "default *": minimum track width 6mil, minimum drill 0.35mm, track to track 24mil, track to pad 24mil, pad to pad 6mil, via to via 6mil, smd to smd 6mil, copper to edge 40mil, drill to drill 6mil, minimum pad ring 10mil, minimum via ring 8mil, stop-mask expansion 4mil, vias tented up to drill 0mil, thermal gap 10mil

### Footprints (pad centres in the part's own frame; a part is rotated, then mirrored left to right if it is on the bottom)
DB = drill 0.813: + -2.54,-3.81 | drill 0.813 octagon: - 2.54,-3.81; AC1 2.54,3.81; AC2 -2.54,3.81
C050-035X075 = drill 0.813 octagon: 1 -2.54,0; 2 2.54,0
C050-030X075 = drill 0.813 octagon: 1 -2.54,0; 2 2.54,0
E3,5-8 = drill 0.813 pad 1.6: + -1.778,0 | drill 0.813 pad 1.6 octagon: - 1.778,0
DO41-10 = drill 1.118 pad 1.93: A 5.08,0; C -5.08,0
LED_5MM = drill 0.813 pad 1.88: A -1.27,0; K 1.27,0
3,3 = hole 3.3: 0,0
DIL40 = drill 0.813 long: 1 -24.13,-7.62; 2 -21.59,-7.62; 3 -19.05,-7.62; 4 -16.51,-7.62; 5 -13.97,-7.62; 6 -11.43,-7.62; 7 -8.89,-7.62; 8 -6.35,-7.62; 9 -3.81,-7.62; 10 -1.27,-7.62; 11 1.27,-7.62; 12 3.81,-7.62; 13 6.35,-7.62; 14 8.89,-7.62; 15 11.43,-7.62; 16 13.97,-7.62; 17 16.51,-7.62; 18 19.05,-7.62; 19 21.59,-7.62; 20 24.13,-7.62; 21 24.13,7.62; 22 21.59,7.62; 23 19.05,7.62; 24 16.51,7.62; 25 13.97,7.62; 26 11.43,7.62; 27 8.89,7.62; 28 6.35,7.62; 29 3.81,7.62; 30 1.27,7.62; 31 -1.27,7.62; 32 -3.81,7.62; 33 -6.35,7.62; 34 -8.89,7.62; 35 -11.43,7.62; 36 -13.97,7.62; 37 -16.51,7.62; 38 -19.05,7.62; 39 -21.59,7.62; 40 -24.13,7.62
78XXL = drill 1.016 long: GND 0,-3.81; IN -2.54,-3.81; OUT 2.54,-3.81 | hole 3.302: 0,11.176
2X8 = drill 1.016 pad 1.88: 1 0,0; 2 0,2.54; 3 2.54,0; 4 2.54,2.54; 5 5.08,0; 6 5.08,2.54; 7 7.62,0; 8 7.62,2.54; 9 10.16,0; 10 10.16,2.54; 11 12.7,0; 12 12.7,2.54; 13 15.24,0; 14 15.24,2.54; 15 17.78,0; 16 17.78,2.54
2X04 = drill 1.016 octagon: 1 -3.81,-1.27; 2 -3.81,1.27; 3 -1.27,-1.27; 4 -1.27,1.27; 5 1.27,-1.27; 6 1.27,1.27; 7 3.81,-1.27; 8 3.81,1.27
S2XXEX = drill 1: 1 -7.62,0; 2 -2.54,0; 3 5.08,0; 4 7.62,0
DIL04 = drill 0.813 long: 1 -1.27,-3.81; 2 1.27,-3.81; 3 1.27,3.81; 4 -1.27,3.81
QS = drill 0.61 long: 1 -2.54,0; 2 2.54,0
0207/10 = drill 0.813 octagon: 1 -5.08,0; 2 5.08,0
F/TMB = drill 1.016 pad 2.159 octagon: + 3.81,0; - -3.81,0
ESP8266-ESP12E = smd 2 x 1.2: 1 -7.62,5.84; 2 -7.62,3.84; 3 -7.62,1.84; 4 -7.62,-0.16; 5 -7.62,-2.16; 6 -7.62,-4.16; 7 -7.62,-6.16; 8 -7.62,-8.16; 9 8.58,-8.16; 10 8.58,-6.16; 11 8.58,-4.16; 12 8.58,-2.16; 13 8.58,-0.16; 14 8.58,1.84; 15 8.58,3.84; 16 8.58,5.84 | smd 1.2 x 2: 17 -4.62,-10.16; 18 -2.62,-10.16; 19 -0.62,-10.16; 20 1.38,-10.16; 21 3.38,-10.16; 22 5.38,-10.16
TO92-EBC-OVAL = drill 0.813 long: B 0,-1.27; C 2.54,-1.27; E -2.54,-1.27
SOIC8 = smd 0.61 x 2.21: 1 -1.905,-2.616; 2 -0.635,-2.616; 3 0.635,-2.616; 4 1.905,-2.616; 5 1.905,2.616; 6 0.635,2.616; 7 -0.635,2.616; 8 -1.905,2.616
SO08 = smd 0.61 x 2.21: 1 -1.905,-2.616; 2 -0.635,-2.616; 3 0.635,-2.616; 4 1.905,-2.616; 5 1.905,2.616; 6 0.635,2.616; 7 -0.635,2.616; 8 -1.905,2.616
DIL16 = drill 0.813 long: 1 -8.89,-3.81; 2 -6.35,-3.81; 3 -3.81,-3.81; 4 -1.27,-3.81; 5 1.27,-3.81; 6 3.81,-3.81; 7 6.35,-3.81; 8 8.89,-3.81; 9 8.89,3.81; 10 6.35,3.81; 11 3.81,3.81; 12 1.27,3.81; 13 -1.27,3.81; 14 -3.81,3.81; 15 -6.35,3.81; 16 -8.89,3.81
W237-102 = drill 1.194 long: 1 -2.5,-1.27; 2 2.5,-1.27

### Placement (x,y rotation side)
B2  12.06,17.78 180 top
B3  24.77,17.78 0 top
C2  114.3,66.04 0 top
C3  59.05,92.71 180 top
C4  83.82,45.09 180 top
C5  66.67,92.71 0 top
C6  103.5,45.09 180 top
C7  17.78,76.83 270 top
C8  38.1,48.26 180 top
C11  83.19,39.37 0 top
C13  114.3,21.59 0 top
C15  114.3,110.49 0 top
C17  48.26,113.03 90 top
C19  92.71,113.03 90 top
C20  90.81,81.92 180 top
C21  25.4,120.02 270 top
C22  6.99,30.48 180 top
C23  14.61,30.48 270 top
C24  34.29,30.48 270 top
C25  59.69,30.48 270 top
C26  66.04,30.48 90 top
C27  40.64,30.48 90 top
C28  46.99,30.48 270 top
C29  53.34,30.48 90 top
C30  51.44,88.9 0 top
C31  21.59,127.64 270 top
C32  114.3,83.82 90 top
C33  114.3,39.37 90 top
C34  114.3,128.27 90 top
C35  30.48,113.03 180 top
C36  74.93,113.03 0 top
D1  139.7,63.5 180 top
D2  139.7,67.31 0 top
D3  139.7,74.93 180 top
D4  139.7,82.55 0 top
D5  139.7,78.74 180 top
D6  139.7,71.12 0 top
D7  114.3,73.66 0 top
D8  114.3,69.85 0 top
D9  45.72,40.01 270 top
D10  125.73,77.47 0 top
D16  139.7,19.05 180 top
D17  139.7,22.86 0 top
D18  139.7,30.48 180 top
D19  139.7,38.1 0 top
D20  139.7,34.29 180 top
D21  139.7,26.67 0 top
D22  114.3,29.21 0 top
D23  114.3,25.4 0 top
D24  125.73,33.02 0 top
D25  139.7,107.95 180 top
D26  139.7,111.76 0 top
D27  139.7,119.38 180 top
D28  139.7,127 0 top
D29  139.7,123.19 180 top
D30  139.7,115.57 0 top
D31  114.3,118.11 0 top
D32  114.3,114.3 0 top
D33  125.73,121.92 0 top
D34  50.8,138.43 270 top
D35  46.99,138.43 90 top
D36  39.37,138.43 270 top
D37  31.75,138.43 90 top
D38  35.56,138.43 270 top
D39  43.18,138.43 90 top
D40  40.64,113.03 90 top
D41  44.45,113.03 90 top
D42  36.83,124.46 90 bottom
D43  95.25,138.43 270 top
D44  91.44,138.43 90 top
D45  83.82,138.43 270 top
D46  76.2,138.43 90 top
D47  80.01,138.43 270 top
D48  87.63,138.43 90 top
D49  85.09,113.03 90 top
D50  88.9,113.03 90 top
D51  82.55,124.46 90 top
D60  4.45,18.41 0 top
H1  25.4,49.53 90 top
H5  109.86,94.61 0 top
H6  122.56,6.99 0 top
H8  6.35,139.06 0 top
IC1  56.52,91.44 0 top
IC2  38.1,17.78 180 top
IC3  63.5,17.78 180 top
IC4  50.8,17.78 180 top
J1  92.71,53.34 270 top
JP1  61.59,76.83 0 top
K1  134.62,86.36 180 top
K2  134.62,41.91 180 top
K3  134.62,130.81 180 top
K4  27.94,133.35 270 top
K5  72.39,133.35 270 top
OK1  127,63.5 90 top
OK3  127,19.05 90 top
OK4  127,107.95 90 top
OK5  50.8,125.73 180 top
OK6  95.25,125.73 180 top
OK7  26.04,7.62 270 top
Q1  61.59,88.9 180 top
R1  139.7,59.69 0 top
R2  114.3,62.23 180 top
R3  59.69,42.55 180 top
R4  59.69,45.09 0 bottom
R5  41.27,67.94 180 top
R6  55.88,69.85 0 top
R7  124.46,82.55 0 top
R8  50.16,76.2 180 top
R9  114.3,58.42 0 top
R10  80.64,32.38 180 top
R11  83.19,51.44 180 top
R12  45.72,45.09 0 top
R13  114.3,77.47 180 top
R14  21.59,101.6 0 top
R18  18.41,9.53 90 top
R19  73.03,72.39 180 top
R20  139.7,15.24 0 top
R21  114.3,17.78 180 top
R22  124.46,38.1 0 top
R23  114.3,15.24 0 top
R24  114.3,33.02 180 top
R25  139.7,104.14 0 top
R26  114.3,106.68 180 top
R27  124.46,127 0 top
R28  114.3,102.87 0 top
R29  114.3,121.92 180 top
R30  54.61,138.43 90 top
R31  52.07,113.03 270 top
R32  31.75,123.19 90 top
R33  55.88,113.03 90 top
R34  36.83,113.03 270 top
R35  99.06,138.43 90 top
R36  96.52,113.03 270 top
R37  76.2,123.19 90 top
R38  100.33,113.03 90 top
R39  81.28,113.03 270 top
R42  9.53,24.13 0 top
SG1  22.23,89.53 270 top
SJR1  52.7,55.88 90 bottom
T1  124.46,71.12 0 top
T3  124.46,26.67 0 top
T4  124.46,115.57 0 top
T5  43.18,123.19 90 top
T6  87.63,123.19 90 top
U1  23.5,76.83 90 bottom
U$1  19.05,120.65 90 bottom
V1  90.81,69.22 270 top
X1  138.43,7.62 90 top
X2  17.78,139.7 0 top
X3  140.97,140.97 270 top
X4  140.97,52.07 270 top
X5  140.97,96.52 270 top
X6  62.23,139.7 0 bottom
X7  8.26,110.49 90 top
X8  8.26,127 90 top
X9  8.26,66.04 90 top
X10  8.26,55.88 90 top
X11  8.26,45.72 90 top
X12  8.89,7.62 270 top
X13  8.26,88.9 90 top
X14  8.26,99.06 90 top
X15  8.26,77.47 90 top

### Tracks (layer width: path | path; a pad name or v marks a point on that pad's centre or on a via)
3V3
  Bottom 0.813: IC3.OUT 59.69,22.86 C25.2 60.45,28.7 C26.+ 66.17,28.57 68.58,28.57 68.58,45.09 | C8.1 SJR1.8 44.55,46.26 52.07,38.73 60.96,38.73 R3.1 R4.1 68.58,45.09 | R6.2 67.31,69.85 70.48,66.67 70.48,46.99 68.58,45.09
5V  (via drill 0.35)
  Top 0.61: v112.39,55.24 v116.84,55.24
  Top 0.813: v57.78,96.52 v52.7,96.52 | v47.62,78.74 v55.24,78.74
  Bottom 0.61: 116.84,60.96 116.84,56.52 | 116.84,56.52 124.46,56.52 127.64,59.69 | 127.64,59.69 127.64,66.04 129.54,67.94 R7.2 K1.3 | 127.64,59.69 132.08,55.24 132.08,45.72 129.54,43.18 K2.3 R22.2 129.54,23.5 127.64,21.59 127.64,13.34 117.47,13.34 113.03,17.78 R21.2 | 24.77,128.27 24.77,132.08 19.05,132.08 18.41,131.44 18.41,118.75 19.68,118.75 U$1.8 22.94,117.47 C21.2 | C7.1 20.24,79.38 U1.4 23.5,78.74 23.5,74.3 15.24,66.04 5.08,66.04 5.08,60.96 12.7,60.96 12.7,55.88 5.08,55.88 5.08,50.8 12.7,50.8 12.7,45.72 6.35,45.72 5.71,45.09 5.71,36.83 17.78,36.83 27.94,36.83 | R2.2 112.39,59.05 v112.39,55.24 | v116.84,55.24 116.84,56.52
  Bottom 0.813: 24.77,128.27 K4.3 R32.2 46.35,128.27 48.26,126.36 54.61,126.36 | 54.61,126.36 56.52,128.27 K5.3 R37.2 90.81,128.27 92.71,126.36 102.23,126.36 | R31.2 52.07,113.03 53.34,114.3 57.78,114.3 57.78,123.19 54.61,126.36 | R36.2 96.52,114.3 102.23,114.3 102.23,126.36 | R26.2 111.76,106.68 118.11,100.33 127.64,100.33 | 127.64,100.33 127.64,110.49 129.54,112.39 R27.2 K3.3 129.54,134.62 110.49,134.62 102.23,126.36 | K1.3 129.54,100.33 127.64,100.33 | IC2.OUT 35.56,24.77 34.29,26.04 C24.2 35.05,28.7 C27.+ 40.77,28.57 43.18,28.57 43.18,36.83 17.78,36.83 17.78,59.05 19.68,59.05 31.11,70.48 45.09,70.48 R8.2 v47.62,78.74 | C7.1 17.78,81.28 15.88,83.19 5.08,83.19 5.08,99.06 18.41,99.06 18.41,104.78 5.08,104.78 5.08,110.49 18.41,110.49 19.68,111.76 19.68,118.75 | IC1.30 v57.78,96.52 | v52.7,96.52 48.9,92.71 C30.1 48.9,87.63 49.53,87 53.98,87 54.61,86.36 54.61,84.45 IC1.10 v55.24,78.74
5V_2  (via drill 0.35)
  Top 0.61: v104.14,52.7 v99.06,52.7 | v91.44,68.58 v91.44,73.03
  Top 0.813: v70.48,21.59 v74.3,21.59
  Bottom 0.61: v99.06,52.7 97.79,52.7 97.16,53.34 J1.2 | v91.44,73.03 91.44,78.11 V1.16 94.61,81.28 93.98,81.92 C20.1 93.34,83.82 83.82,83.82 78.11,78.11 | v91.44,68.58 91.44,64.14 92.71,62.87 V1.10 96.52,62.87 104.14,55.24 v104.14,52.7 106.05,50.8 C6.1
  Bottom 0.813: IC4.OUT 48.26,24.13 46.99,25.4 C28.2 52.58,27.94 C29.+ 54.48,28.7 55.88,27.3 55.88,17.14 57.78,15.24 64.14,15.24 66.04,17.14 IC3.IN v70.48,21.59 | 78.11,78.11 R19.1 78.11,54.61 80.01,52.7 80.01,50.16 76.83,46.99 76.83,43.18 75.56,41.91 75.56,34.92 77.47,33.02 77.47,22.86 76.2,21.59 v74.3,21.59
9V_AC1
  Bottom 0.813: X12.1 9.53,12.03 B2.AC1 13.97,18.41 17.78,18.41 18.41,19.05 18.41,22.86 19.68,24.13 26.04,24.13 27.3,22.86 B3.AC1
9V_AC2
  Bottom 0.813: X12.2 10.76,5.12 10.79,5.08 14.61,8.89 B2.AC2 17.14,16.51 20.32,16.51 22.23,18.41 B3.AC2
A
  Bottom 0.61: R10.1 89.53,32.38 J1.15
A_RX
  Bottom 0.61: JP1.8 IC1.14
A_TX  (via drill 0.35)
  Top 0.61: v62.87,80.64 v67.94,80.64
  Bottom 0.61: JP1.6 v62.87,80.64 | v67.94,80.64 IC1.15
BUZZER
  Bottom 0.61: SG1.+ 24.13,83.82 IC1.1
CH_PD  (via drill 0.35)
  Top 0.813: v60.33,67.31 v55.24,67.31
  Bottom 0.61: JP1.3 60.33,74.93 55.24,69.85 v55.24,67.31
  Bottom 0.813: SJR1.3 54.55,45.15 R4.2 52.7,43.18 52.7,40.64 59.69,40.64 61.59,42.55 61.59,46.35 62.23,46.99 67.94,46.99 68.58,47.62 68.58,66.04 67.31,67.31 v60.33,67.31
CH_PD_MEGA  (via drill 0.35)
  Top 0.61: v50.16,80.64 v60.33,80.64
  Bottom 0.61: IC1.8 v50.16,80.64 | v60.33,80.64 JP1.4
CON_PWM
  Bottom 0.813: R11.2 76.2,51.44 76.2,78.74 78.11,80.64 IC1.19
D4
  Bottom 0.61: V1.3 85.09,73.03 83.82,71.75 83.82,49.53 80.01,45.72 80.01,41.91 78.74,40.64 78.74,37.47 80.01,36.2 87.63,36.2 88.9,37.47 88.9,40.64 J1.11
D5  (via drill 0.35)
  Top 0.61: v99.06,40.64 v102.87,40.64 | v82.55,57.78 v92.71,57.78
  Bottom 0.61: J1.12 v99.06,40.64 | v102.87,40.64 102.87,54.61 99.69,57.78 v92.71,57.78 | V1.2 84.68,75.56 82.55,73.43 82.55,68.58 v82.55,57.78
D6
  Bottom 0.61: V1.1 83.19,78.11 81.28,76.2 81.28,48.9 78.74,46.35 78.74,42.55 77.52,41.33 | J1.13 91.44,38.1 88.27,34.92 78.74,34.92 77.47,36.2 77.47,41.27 77.52,41.33 | 77.52,41.33 77.52,41.27
D7  (via drill 0.35)
  Top 0.61: v102.87,38.1 v99.06,38.1 | v102.23,75.56 v97.16,75.56
  Bottom 0.61: v99.06,38.1 J1.14 | v97.16,75.56 V1.15 | v102.23,75.56 102.23,59.05 108.99,52.3 108.99,40.23 106.69,40.23 104.56,38.1 v102.87,38.1
DOOR_SEN
  Bottom 0.61: X11.1 13.38,43.22 15.88,45.72 15.88,60.96 19.05,60.96 30.48,72.39 43.18,72.39 43.18,78.11 46.35,81.28 47.62,81.28 IC1.7
DW
  Bottom 0.61: X14.1 9.56,96.52 21.59,96.52 21.59,103.5 22.86,104.78 26.67,104.78 IC1.40
E_5
  Bottom 0.813: SJR1.5 50.8,48.01 R12.2
E_8
  Bottom 0.813: SJR1.10 46.55,67.75 R5.1
E_RX
  Bottom 0.61: SJR1.15 57.03,64.95 57.03,69.87 59.94,72.78 60.13,72.97 62.72,75.56 JP1.5
E_TX
  Bottom 0.61: SJR1.16 59,64.92 59,70.12 62.77,73.89 63.56,73.89 65.24,75.56 JP1.7
EN
  Bottom 0.61: J1.6 101.6,48.26 101.6,53.98 99.06,56.52 90.81,56.52 90.81,62.23 88.9,64.14 88.9,65.41 V1.6
EN_HEATER_SSR
  Bottom 0.61: X7.1 26,107.99 32.38,101.6 40.01,101.6 IC1.37
EN_PUMP
  Bottom 0.61: 107.31,15.24 107.31,38.73 110.49,38.73 110.49,52.7 103.5,59.69 103.5,85.72 99.69,89.53 73.03,89.53 IC1.24
  Bottom 0.813: R23.1 107.31,15.24
EN_S1_GAS
  Bottom 0.61: R33.1 55.88,104.14 52.7,104.14 50.16,101.6 IC1.33
EN_S2_WAT
  Bottom 0.61: R28.1 108.58,102.23 108.58,101.6 67.94,101.6 IC1.26
EN_S3_VAP
  Bottom 0.61: R38.1 100.33,104.14 64.77,104.14 62.87,102.23 IC1.28
EN_S4_DRY
  Bottom 0.61: R9.1 106.05,61.59 106.05,87 100.97,92.08 78.74,92.08 78.11,92.71 IC1.22
GND  (via drill 0.35)
  Top 0.61: v85.09,55.88 v80.01,55.88
  Top 0.813: v17.14,113.03 v24.13,113.03
  Bottom 0.61: T1.E D8.A 116.84,69.85 114.3,67.31 C33.2 | T1.E 121.92,77.47 R13.1 119.38,79.38 114.3,85.09 C32.2 116.84,88.9 116.84,99.14 113.99,101.99 | OK1.3 121.92,66.04 T1.E | OK3.3 120.65,22.86 120.65,25.4 | 120.65,25.4 T3.E 121.92,30.48 R24.1 116.84,35.56 116.84,38.1 114.3,40.64 C33.2 | 120.65,25.4 D23.A | C33.2 114.3,41.27 | 114.3,101.6 113.99,101.99 | 113.99,101.99 111.12,104.78 107.31,104.78 107.31,108.58 114.3,108.58 114.3,111.76 116.84,114.3 D32.A | D50.A 88.9,114.94 90.81,113.03 94.61,113.03 94.61,106.68 95.25,106.05 97.79,106.05 98.42,106.68 98.42,111.12 102.87,111.12 104.14,112.39 104.14,125.09 109.86,130.81 C34.2 115.57,130.81 116.84,129.54 116.84,124.46 R29.1 | 58.42,111.76 59.69,111.76 62.87,114.94 77.47,114.94 | 58.42,111.76 53.98,111.76 53.98,106.05 50.16,106.05 50.16,113.03 46.35,113.03 46.35,113.67 44.45,115.57 D41.A | C31.2 21.67,125.02 U$1.5 C21.1 28.57,122.56 29.21,121.92 29.21,115.57 | U1.1 20.24,74.3 C7.2 | v24.13,113.03 C35.2 29.21,114.3 29.21,115.57 | IC1.31 55.24,100.97 58.42,104.14 58.42,111.76 | J1.9 J1.7 | J1.7 J1.5 | J1.7 J1.8 J1.10 | J1.9 J1.10 | J1.9 88.9,43.18 87.63,41.91 87.63,38.1 87,37.47 82.55,37.47 C11.1 81.28,39.37 81.92,40.01 81.92,44.96 C4.- 85.09,48.13 85.09,52.7 85.72,53.34 87,53.34 | 91.44,53.34 J1.1 87,53.34 | 87,55.88 V1.8 | 100.97,43.18 100.97,35.56 J1.16 95.25,28.57 69.85,3.17 55.24,3.17 54.18,2.11 29.84,2.11 21,2.11 20.57,2.54 4.45,2.54 4.45,17.14 D60.K | J1.10 100.97,43.18 | C6.2 100.97,43.18 | 87,55.88 v85.09,55.88 | v80.01,55.88 80.01,78.11 82.32,80.42 88.27,80.42 | 88.27,80.42 88.9,80.42 89.53,79.78 89.53,70.48 V1.13 | C20.2 88.27,80.42
  Bottom 0.61: 81.28,115.57 80.64,114.94 77.47,114.94 | C36.2 77.47,114.94 | 29.21,115.57 36.83,115.57 | 87,55.88 87,53.34 | D9.K 50.8,33.66 50.8,33.02
  Bottom 0.813: 81.28,115.57 R39.1 81.28,120.65 T6.E | D50.A T6.E | T5.E 36.83,120.65 R34.1 36.83,115.57 | OK5.3 48.26,120.65 T5.E | OK6.3 92.71,120.65 T6.E | D41.A T5.E | OK4.3 121.92,110.49 T4.E | T4.E D32.A | T4.E 121.92,121.92 R29.1 | 3.17,101.6 3.17,91.44 | 3.17,91.44 3.21,91.4 | 3.21,68.54 X9.2 11.39,68.54 17.14,74.3 C7.2 | 3.21,68.54 3.17,68.58 3.17,91.44 | X10.2 3.21,58.38 3.17,58.42 | 3.17,58.42 3.17,68.5 3.21,68.54 | 3.17,58.42 3.17,48.26 | 3.17,48.26 3.21,48.22 X11.2 | 3.17,33.66 3.17,32.51 C22.- 5.21,27.18 9.53,22.86 B2.- 9.53,18.41 D60.K | 3.17,33.66 3.17,48.26 | 3.17,33.66 13.97,33.66 C23.1 31.75,33.02 | 31.75,33.02 C24.1 39.88,33.02 C27.- | 31.75,33.02 32.38,32.38 32.38,18.41 33.66,17.14 38.1,17.14 IC2.GND 38.1,24.77 43.18,24.77 | 43.18,24.77 43.18,14.61 50.8,14.61 IC4.GND | 43.18,24.77 45.09,26.67 45.09,33.02 C28.1 50.8,33.02 51.44,33.02 | 51.44,33.02 52.58,33.02 C29.- 57.78,32.26 | C26.- 60.45,32.26 C25.1 59.05,33.02 58.29,32.26 57.78,32.26 | IC3.GND 63.5,17.78 62.87,17.14 59.05,17.14 57.78,18.41 57.78,32.26 | 3.21,112.99 3.17,113.03 | 3.17,113.03 3.17,101.6 | 3.17,113.03 9.48,113.03 X7.2 9.56,113.03 v17.14,113.03 | 3.17,101.6 3.21,101.56 X14.2 16.47,101.56 R14.1 | SJR1.9 35.88,64.46 | 35.88,64.46 35.87,64.46 | R5.2 35.56,67.31 35.56,64.14 | 35.56,64.14 C8.2 35.56,38.73 D9.K 51.44,33.02 | 35.88,64.46 35.56,64.14 | C5.1 C3.1 59.69,94.61 55.24,94.61 | 55.24,94.61 53.98,94.61 C30.2 54.61,88.9 57.78,85.72 IC1.11 | 55.24,94.61 IC1.31 | OK7.3 29.84,2.11
HEATER_FED_SIG
  Bottom 0.61: U$1.7 25.4,120.02 27.3,118.11 27.3,115.57 26.67,114.94 22.23,114.94 22.23,111.12 23.5,109.86 27.3,109.86 33.66,103.5 41.91,103.5 42.55,102.87 IC1.36
HEATER_T1
  Bottom 0.61: U$1.3 16.43,121.92 U$1.4
  Bottom 1.905: 16.43,121.92 13.97,121.92 13.97,129.54 9.56,129.54 X8.2
HEATER_T2
  Bottom 0.61: U$1.2 16.43,119.38 U$1.1
  Bottom 1.905: 16.43,119.38 9.53,119.38 X8.1
IO0
  Bottom 0.813: SJR1.12 50.8,64.72 R6.1
L
  Bottom 0.813: R1.2 D1.C 147.32,63.5 147.32,71.12 | 147.32,71.12 D6.A | 147.32,71.12 147.32,104.14 R25.2 D25.C 147.32,107.95 147.32,115.57 | 147.32,115.57 D30.A | 147.32,115.57 147.32,146.05 99.06,146.05 R35.2 D43.C 95.25,146.05 87.63,146.05 | 87.63,146.05 D48.A | 87.63,146.05 54.61,146.05 R30.2 D34.C 50.8,146.05 43.18,146.05 D39.A
  Bottom 1.27: X1.1 144.74,5.12 144.78,5.16 R20.2 D16.C 147.32,19.05 147.32,26.67 | 147.32,26.67 147.32,59.69 R1.2 | D21.A 147.32,26.67
LCD_CLK
  Bottom 0.61: V1.11 97.79,65.41 100.97,68.58 100.97,83.82 96.52,88.27 71.12,88.27 71.12,95.25 70.48,95.89 IC1.25
LCD_D
  Bottom 0.61: V1.14 97.16,73.03 98.42,74.3 98.42,81.92 95.25,85.09 81.92,85.09 IC1.20
LCD_L
  Bottom 0.61: V1.12 97.16,67.94 99.69,70.48 99.69,83.19 95.89,87 73.03,87 IC1.17
LED_PWM
  Bottom 0.813: IC1.18 75.56,81.92 74.3,80.64 74.3,43.18 73.03,41.91 73.03,32.38 R10.2
N
  Bottom 0.813: 139.7,93.98 139.7,59.69 135.89,55.88 135.89,49.53 139.7,49.53 X4.2 | 139.7,93.98 X5.2 | 135.89,93.98 135.89,100.33 139.7,104.14 X3.2 80.05,138.47 80.01,138.43 68.58,138.43 68.58,134.62 59.69,134.62 59.73,134.66 X6.2 X2.2 | 135.89,93.98 135.93,94.02 | 135.89,93.98 139.7,93.98 | 139.66,10.16 X1.2
  Bottom 1.27: X1.2 139.7,49.53
N$1
  Bottom 0.813: D2.A 142.24,67.31 142.24,74.93 D3.C
N$2
  Bottom 0.813: D1.A D2.C
N$3
  Bottom 0.61: OK1.4 R2.1 116.84,64.77 C2.2
N$4
  Bottom 0.61: C2.1 111.76,69.85 | 111.76,69.85 D8.C | 111.76,69.85 115.57,73.66 D7.A
N$5
  Bottom 0.813: D6.C 137.16,71.12 137.16,78.74 D5.A
N$6
  Bottom 0.813: D5.C D4.A
N$7
  Bottom 0.813: IC1.13 62.87,87.63 Q1.1 65.41,88.9 C5.2
N$8
  Bottom 0.61: T1.C D10.K K1.4
N$9
  Bottom 0.61: R1.1 133.35,59.69 OK1.1
N$10
  Bottom 1.27: D17.A 142.24,25.4 142.24,28.57 144.15,30.48 D18.C
N$11
  Bottom 0.61: R7.1 124.46,82.55 D10.A
N$12
  Bottom 0.813: D9.A 41.91,45.09 R12.1
N$13
  Bottom 0.61: R9.2 123.19,58.42 125.73,60.96 125.73,66.04 124.46,67.31 T1.B
N$14
  Bottom 0.61: 132.08,66.04 132.08,72.39
  Bottom 0.813: OK1.2 132.08,66.04 132.08,74.93 | 132.08,74.93 132.08,81.28 133.35,82.55 D4.C 134.62,86.36 K1.2 | D3.A 132.08,74.93
N$15
  Bottom 1.27: D16.A D17.C
N$16
  Bottom 0.813: IC1.12 60.33,87 59.05,88.27 Q1.2 59.05,90.17 C3.2
N$17
  Bottom 0.813: 135.25,34.29 D20.A
  Bottom 1.27: D21.C 137.16,29.21 137.16,32.38 135.25,34.29
N$18
  Bottom 1.27: D20.C D19.A
N$19
  Bottom 0.61: OK3.1 133.35,15.24 R20.1
N$20
  Bottom 0.61: OK3.4 R21.1 119.38,19.05 C13.2
N$21
  Bottom 0.61: D22.A 118.11,29.21 114.3,25.4 111.76,25.4 | 111.76,25.4 D23.C | C13.1 111.76,25.4
N$22
  Bottom 0.813: OK3.2 130.81,20.95 132.08,22.23 132.08,33.02
  Bottom 1.27: D18.A 132.08,33.02 132.08,35.56 D19.C 134.62,41.91 K2.2
N$23
  Bottom 0.61: D24.A R22.1
N$24
  Bottom 0.61: T3.C D24.K K2.4
N$25
  Bottom 0.61: T3.B 124.46,22.86 125.73,21.59 125.73,15.24 R23.2
N$26
  Bottom 0.813: D26.A 142.24,111.76 142.24,119.38 D27.C
N$27
  Bottom 0.813: D25.A D26.C
N$28
  Bottom 0.813: D30.C 137.16,115.57 137.16,123.19 D29.A
N$29
  Bottom 0.813: D29.C D28.A
N$30
  Bottom 0.813: R25.1 132.08,106.68 OK4.1
N$31
  Bottom 0.813: OK4.4 R26.1 118.11,106.68 116.84,107.95 C15.2
N$32
  Bottom 0.813: D32.C 113.03,114.3 | 113.03,114.3 111.76,113.03 C15.1 | 113.03,114.3 116.84,118.11 D31.A
N$33
  Bottom 0.813: K3.2 134.62,130.81 D28.C 132.08,124.46 132.08,119.38 | 132.08,119.38 D27.A | 132.08,119.38 132.08,111.76 130.81,110.49 OK4.2
N$34
  Bottom 0.813: D33.A 124.46,127 R27.1
N$35
  Bottom 0.813: K3.4 D33.K T4.C
N$36
  Bottom 0.813: R28.2 125.73,102.87 125.73,110.49 124.46,111.76 T4.B
N$37
  Bottom 0.813: D36.C 39.37,140.97 46.99,140.97 D35.A
N$38
  Bottom 0.813: D34.A D35.C
N$39
  Bottom 0.813: D39.C 43.18,135.89 35.56,135.89 D38.A
N$40
  Bottom 0.813: D38.C D37.A
N$41
  Bottom 0.813: OK5.1 54.61,132.08 R30.1
N$42
  Bottom 0.813: OK5.4 R31.1 49.53,115.57 C17.2
N$43
  Bottom 0.813: D40.A 40.64,114.3 44.45,110.49 | 44.45,110.49 C17.1 | D41.C 44.45,110.49
N$44
  Bottom 0.813: K4.2 27.94,133.35 D37.C 34.29,130.81 39.37,130.81 | 39.37,130.81 D36.A | 39.37,130.81 46.99,130.81 48.26,129.54 OK5.2
N$45
  Bottom 0.813: R32.1 31.75,123.19 D42.A
N$46
  Bottom 0.813: T5.C D42.K K4.4
N$47
  Bottom 0.813: B3.+ 19.05,13.97 R18.2
N$48
  Bottom 0.813: R18.1 18.41,8.89 OK7.1
N$49
  Bottom 0.813: OK7.2 26.04,6.35 26.04,12.7 B3.-
N$52
  Bottom 0.813: R33.2 55.88,121.92 53.34,124.46 46.99,124.46 45.72,123.19 T5.B
N$53
  Bottom 0.813: D45.C 83.82,140.97 91.44,140.97 D44.A
N$56
  Bottom 0.813: D44.C D43.A
N$57
  Bottom 0.813: D47.A 80.01,135.89 87.63,135.89 D48.C
N$58
  Bottom 0.813: D46.A D47.C
N$59
  Bottom 0.813: R35.1 96.52,130.81 OK6.1
N$60
  Bottom 0.813: C19.2 95.25,118.11 R36.1 OK6.4
N$61
  Bottom 0.813: D49.A 85.09,115.57 88.9,111.76 | 88.9,111.76 90.17,110.49 C19.1 | D50.C 88.9,111.76
N$62
  Bottom 0.813: SG1.- 26.67,93.34 R14.2
N$63
  Bottom 0.813: K5.2 72.39,133.35 D46.C 78.74,130.81 83.82,130.81 | 83.82,130.81 D45.A | 83.82,130.81 91.44,130.81 92.71,129.54 OK6.2
N$64
  Bottom 0.813: D51.A 76.2,123.19 R37.1
N$65
  Bottom 0.813: K5.4 D51.K T6.C
N$66
  Bottom 0.813: T6.B 91.44,123.19 92.71,124.46 100.33,124.46 R38.2
N$74
  Bottom 0.813: R42.1 3.17,22.86 D60.A
N$80
  Bottom 0.61: C31.1 19.68,130.18 19.68,121.28 U$1.6
NRST
  Bottom 0.813: SJR1.1 58.55,42.67 58.42,42.55 R3.2
OK
  Bottom 0.61: X13.2 18.45,91.4 19.68,90.17 31.11,90.17 34.92,93.98 IC1.39
OUT_PUMP
  Bottom 0.813: K5.1 64.77,140.97 64.73,140.93 X6.1
OUT_S1_GAS
  Bottom 0.813: K4.1 27.94,142.24 15.24,142.24 15.28,142.2 X2.1
OUT_S2_WAT
  Bottom 0.813: K3.1 143.51,130.81 143.51,143.51 139.74,143.51 X3.1
OUT_S3_VAP
  Bottom 1.27: K2.1 143.51,41.91 143.51,54.53 143.55,54.57 X4.1 139.1,54.57 139.06,54.61
OUT_S4_DRY
  Bottom 0.813: K1.1 143.51,86.36 143.51,99.06 139.74,99.06 X5.1
PRES_SEN
  Bottom 0.61: X10.1 13.38,53.38 14.61,54.61 14.61,62.23 18.41,62.23 29.84,73.66 41.91,73.66 41.91,78.74 45.09,81.92 IC1.6
PUMP_FED_SIG
  Bottom 0.61: D22.C R24.2 109.22,36.83 111.76,36.83 | IC1.23 75.56,90.81 100.33,90.81 104.78,86.36 104.78,60.33 111.76,53.34 111.76,36.83 | C33.1 111.76,36.83
REST
  Bottom 0.61: R8.1 57.15,78.11 JP1.2
  Bottom 0.813: R8.1 52.7,78.74 IC1.9
REST_OUT
  Bottom 0.61: SJR1.13 52.55,68.97 52.65,69.08 52.65,69.16 57.78,74.3 JP1.1 57.78,74.93
  Bottom 0.813: SJR1.13 52.7,64.62
RS
  Bottom 0.61: J1.4 100.33,50.8 100.33,53.34 98.42,55.24 89.53,55.24 89.23,55.55 89.23,61.27 87.63,62.87 V1.7
S1_GAS_FED_SIG
  Bottom 0.61: D40.C 45.09,103.5 IC1.35 | 36.83,111.76 35.56,113.03 C35.1
  Bottom 0.813: 36.83,111.76 R34.2 D40.C
S2_WAT_FED_SIG
  Bottom 0.61: D31.C 106.68,115.57 106.68,111.76 104.78,109.86 104.78,102.87 66.04,102.87 65.41,102.23 IC1.27 | R29.2 113.03,125.73 C34.1
  Bottom 0.813: D31.C R29.2
S3_VAP_FED_SIG
  Bottom 0.61: R39.2 79.38,106.05 72.39,106.05 | 72.39,106.05 62.87,106.05 60.33,103.5 IC1.29 | 72.39,106.05 C36.1
  Bottom 0.813: D49.C R39.2
S4_DRY_FED_SIG
  Bottom 0.61: D7.C R13.2 113.03,81.28 C32.1 113.35,81.6 113.35,82.23 102.23,93.34 81.28,93.34 80.64,93.98 IC1.21
T_CLK
  Bottom 0.61: U1.6 37.47,77.47 IC1.3
T_CS
  Bottom 0.61: U1.5 34.92,78.74 IC1.2
T_DO
  Bottom 0.61: U1.7 39.37,76.2 39.37,80.01 40.01,80.64 IC1.4
TCK+
  Bottom 0.61: X15.2 9.56,80.01 12.7,80.01 15.24,77.47 U1.3
TCK-
  Bottom 0.61: X15.1 14.01,74.97 15.24,76.2 U1.2
UP
  Bottom 0.61: X13.1 17.82,86.4 19.68,88.27 23.5,88.27 25.4,86.36 29.84,86.36 37.47,93.98 IC1.38
VEE
  Bottom 0.61: C11.2 85.72,44.96 C4.+ 86.87,46.35 88.27,46.35 R11.1 88.9,50.8 J1.3
VIN
  Bottom 0.813: B2.+ R42.2 C23.2 | C23.2 13.97,28.57 10.16,28.57 8.76,29.97 C22.+ | 40.64,14.61 33.66,14.61 33.02,14.61 31.11,14.61 29.84,15.88 29.84,24.77 26.67,27.94 C23.2 | 40.64,14.61 IC2.IN | 40.64,14.61 40.64,12.7 53.34,12.7 IC4.IN
WATER_SEN
  Bottom 0.61: 14.64,63.54 X9.1 17.82,63.54 29.21,74.93 40.64,74.93 40.64,79.38 42.55,81.28 IC1.5
ZERO_CROSS
  Bottom 0.813: 70.48,72.39 70.48,69.85 72.39,67.94 72.39,43.81 71.12,42.55 71.12,31.11 72.39,29.84 72.39,15.24 68.58,11.43 54.08,11.43 53.93,11.28 32.23,11.28 OK7.4 | 70.48,72.39 IC1.16 | R19.2 70.48,72.39
(copper drawn outside any net)
  shapes: Top area x2

### Text on the board
Top: WIFI LED